# Altium project IMX8SoCIot.PrjPcb (part 2 of 4)

## Sheet IMX8_IO.SchDoc
size 594 x 420 mm; SheetNumber: 4; SheetTotal: 12
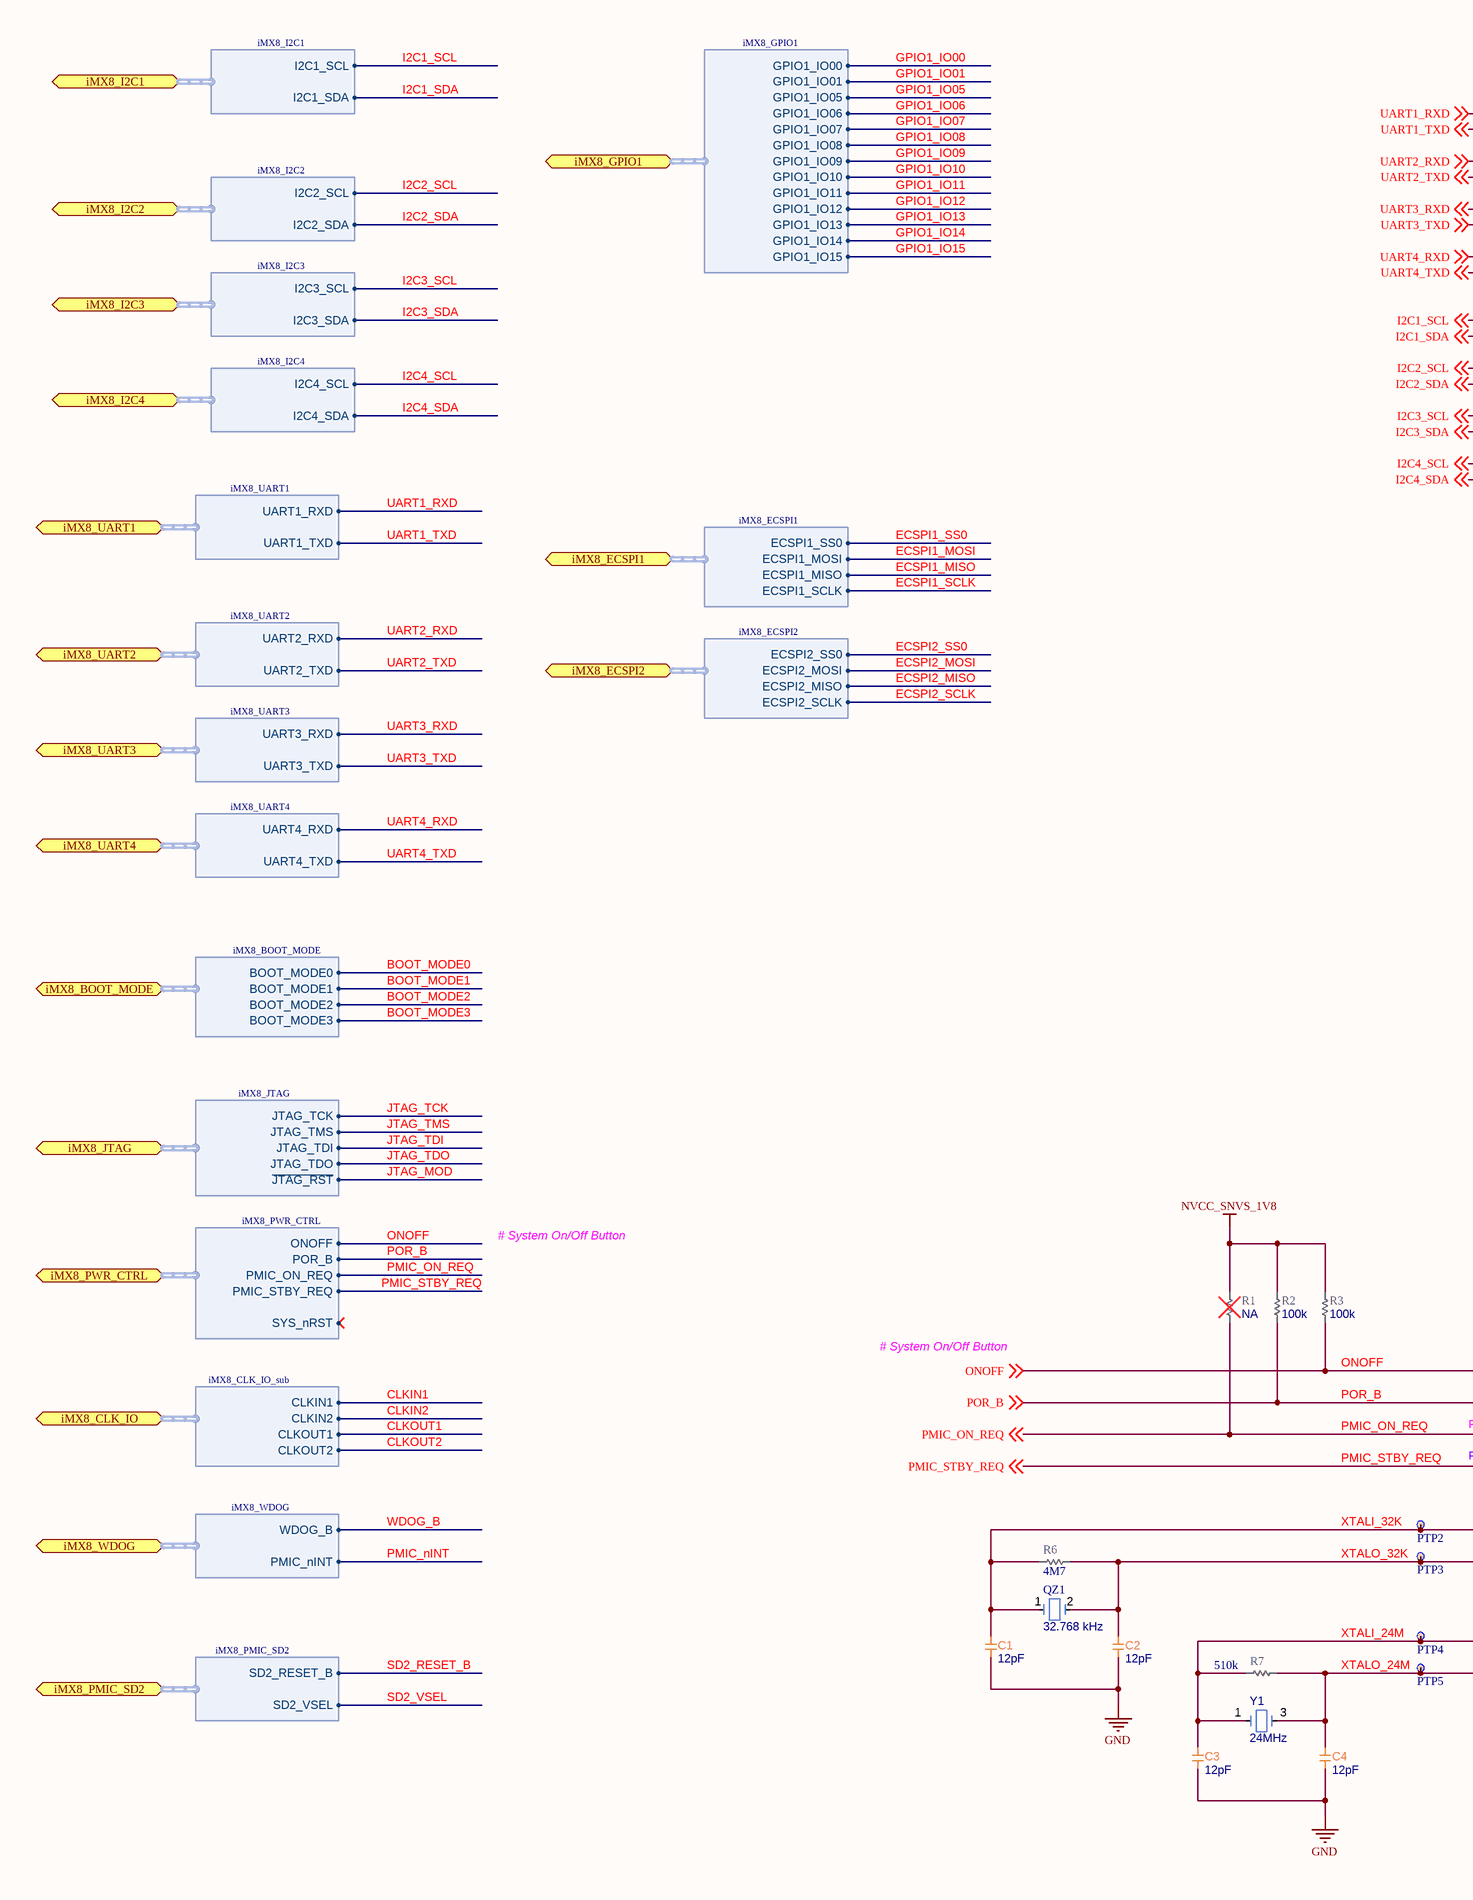
[diagram p8: IMX8_IO.SchDoc, left]
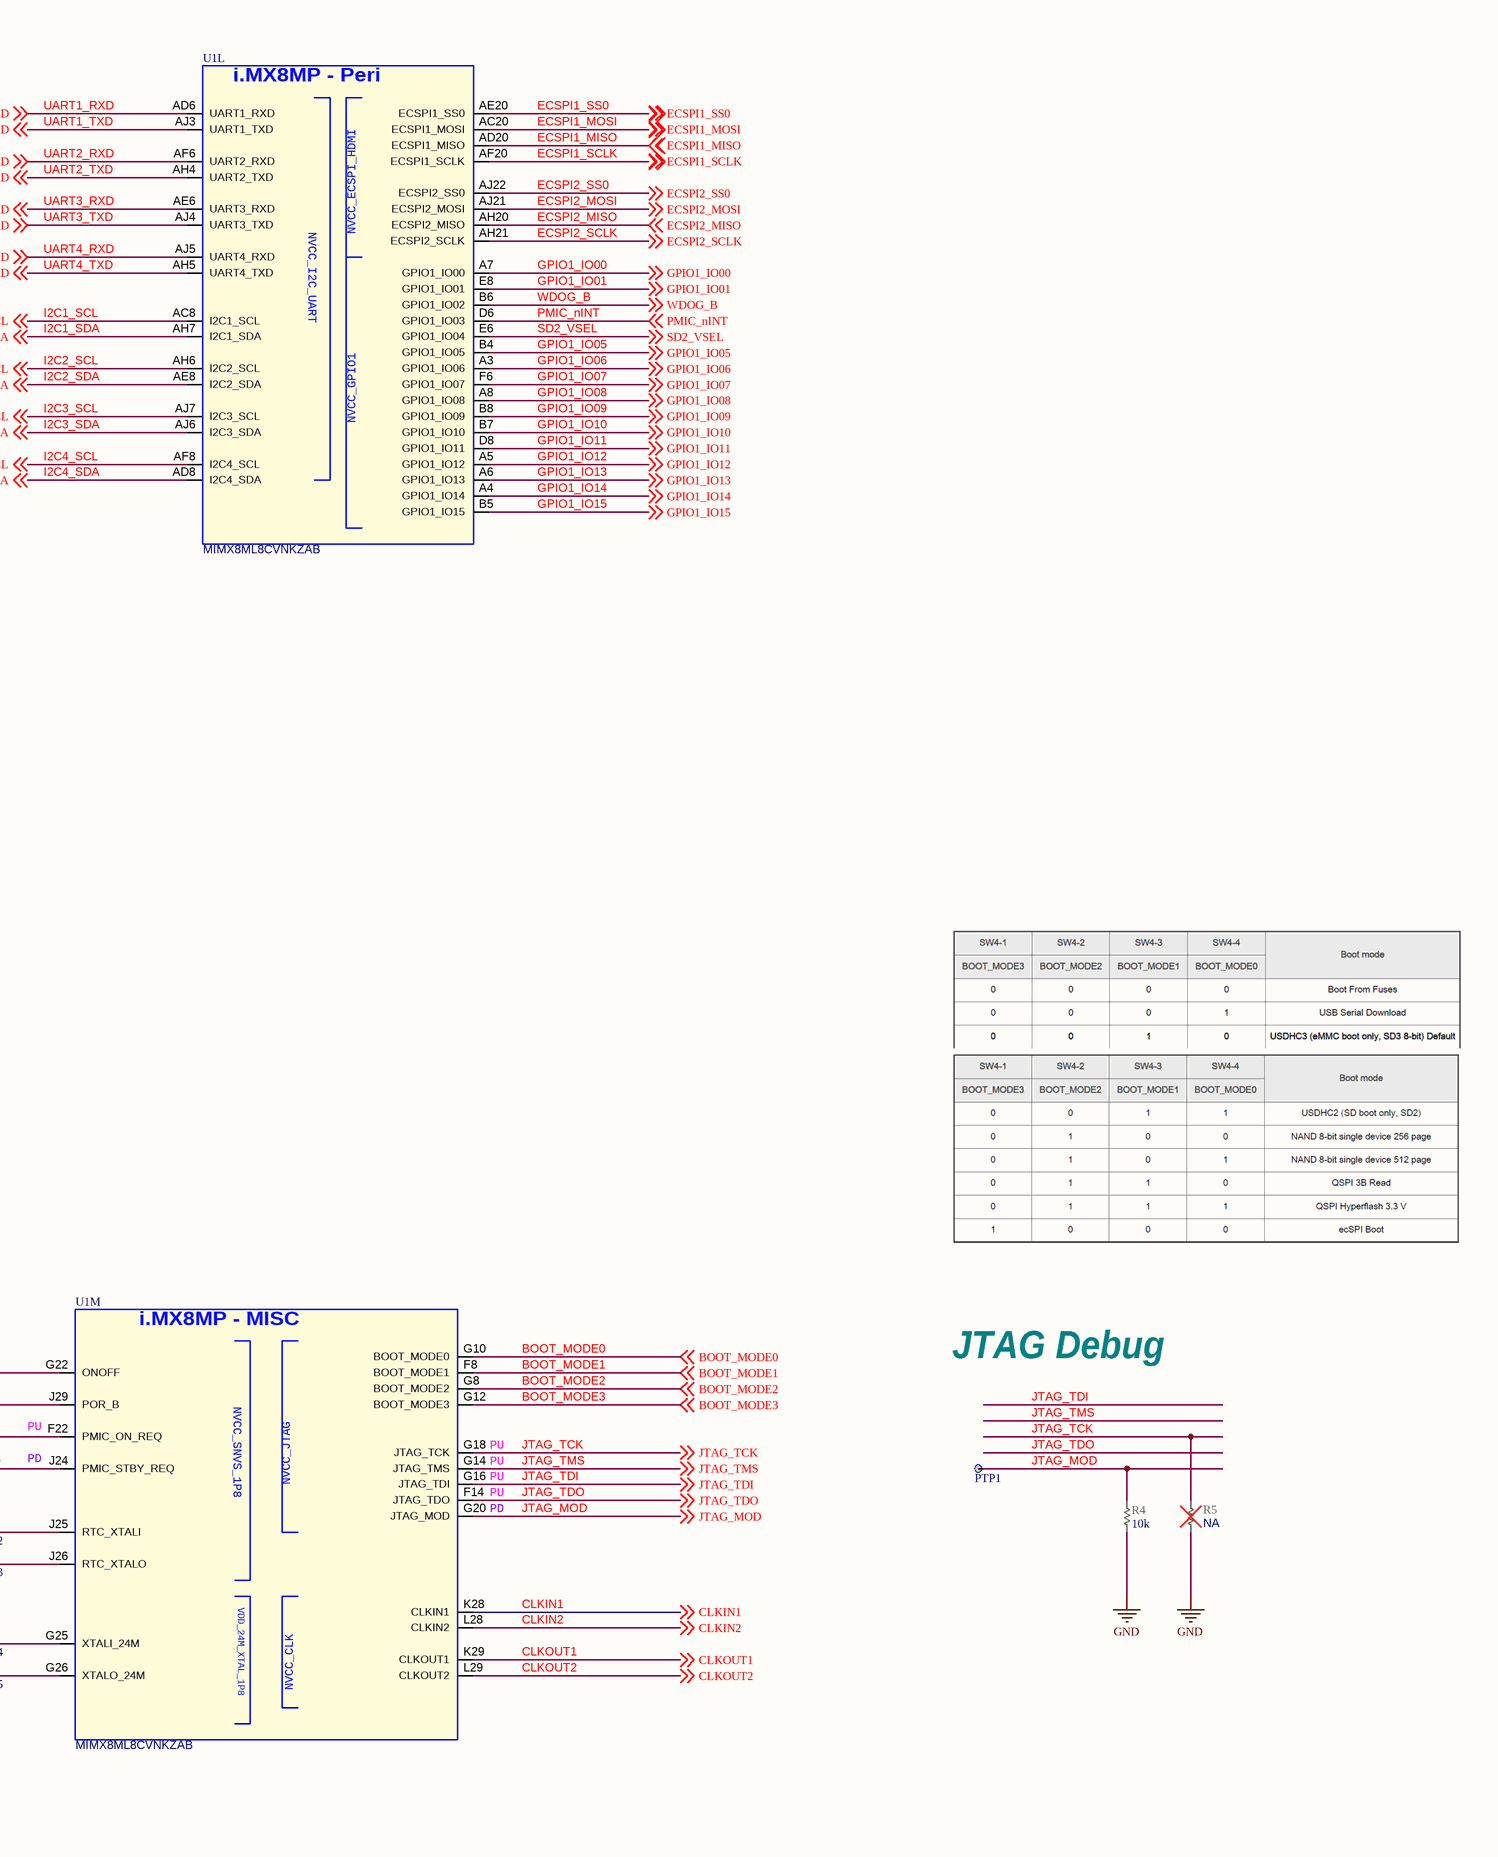
[diagram p9: IMX8_IO.SchDoc, right]

### Parts
C1  value 12pF  [CAP_0201_UN1Q]  (hidden comment: CAP_0201_12pF_RF_MATCHING)
C2  value 12pF  [CAP_0201_UN1Q]  (hidden comment: CAP_0201_12pF_RF_MATCHING)
C3  value 12pF  [CAP_0201_UN1Q]  (hidden comment: CAP_0201_12pF_RF_MATCHING)
C4  value 12pF  [CAP_0201_UN1Q]  (hidden comment: CAP_0201_12pF_RF_MATCHING)
PTP1  PTP_0.4mm  [PTP_0.4mm]  (value not drawn)  (no BOM)
PTP2  PTP_0.4mm  [PTP_0.4mm]  (value not drawn)  (no BOM)
PTP3  PTP_0.4mm  [PTP_0.4mm]  (value not drawn)  (no BOM)
PTP4  PTP_0.4mm  [PTP_0.4mm]  (value not drawn)  (no BOM)
PTP5  PTP_0.4mm  [PTP_0.4mm]  (value not drawn)  (no BOM)
QZ1  value 32.768 kHz  [CM8V32768TA020125_MC]  (hidden comment: XTAL_CM8V-T1A-32_768KHZ-9PF-20PPM-TA-QC)
R1  value NA  [RES_0201_UN1Q]  (hidden comment: RES_0201_NA)
R2  value 100k  [RES_0201_UN1Q]  (hidden comment: RES_0201_100k)
R3  value 100k  [RES_0201_UN1Q]  (hidden comment: RES_0201_100k)
R4  value 10k  [RES_0201_UN1Q]  (hidden comment: RES_0201_10k)
R5  value NA  [RES_0201_UN1Q]  (hidden comment: RES_0201_NA)
R6  value 4M7  [RES_0201_UN1Q]  (hidden comment: RES_0201_4M7)
R7  value 510k  [RES_0201_UN1Q]  (hidden comment: RES_0201_510k)
U1  MIMX8ML8CVNKZAB  [BGA548C50P29X29_1500X1500X148]  (parts L,M of 15)
Y1  value 24MHz  [XTAL_3225_EPSON]  (hidden comment: XTAL_24M_10ppm_9pF_+105C)

### Ports
iMX8_BOOT_MODE (bidir, harness iMX8_BOOT_MODE), iMX8_CLK_IO (bidir, harness iMX8_CLK_IO_sub), iMX8_ECSPI1 (bidir, harness iMX8_ECSPI1), iMX8_ECSPI2 (bidir, harness iMX8_ECSPI2), iMX8_GPIO1 (bidir, harness iMX8_GPIO1), iMX8_I2C1 (bidir, harness iMX8_I2C1), iMX8_I2C2 (bidir, harness iMX8_I2C2), iMX8_I2C3 (bidir, harness iMX8_I2C3), iMX8_I2C4 (bidir, harness iMX8_I2C4), iMX8_JTAG (bidir, harness iMX8_JTAG), iMX8_PMIC_SD2 (bidir, harness iMX8_PMIC_SD2), iMX8_PWR_CTRL (bidir, harness iMX8_PWR_CTRL), iMX8_UART1 (bidir, harness iMX8_UART1), iMX8_UART2 (bidir, harness iMX8_UART2), iMX8_UART3 (bidir, harness iMX8_UART3), iMX8_UART4 (bidir, harness iMX8_UART4), iMX8_WDOG (bidir, harness iMX8_WDOG)

### Harnesses
iMX8_JTAG: JTAG_TCK, JTAG_TMS, JTAG_TDI, JTAG_TDO, ~{JTAG_RST}
iMX8_CLK_IO_sub: CLKIN1, CLKIN2, CLKOUT1, CLKOUT2
iMX8_PWR_CTRL: ONOFF, POR_B, PMIC_ON_REQ, PMIC_STBY_REQ, SYS_nRST
iMX8_I2C1: I2C1_SCL, I2C1_SDA
iMX8_I2C2: I2C2_SCL, I2C2_SDA
iMX8_I2C3: I2C3_SCL, I2C3_SDA
iMX8_I2C4: I2C4_SCL, I2C4_SDA
iMX8_UART1: UART1_RXD, UART1_TXD
iMX8_UART2: UART2_RXD, UART2_TXD
iMX8_UART3: UART3_RXD, UART3_TXD
iMX8_UART4: UART4_RXD, UART4_TXD
iMX8_GPIO1: GPIO1_IO00, GPIO1_IO01, GPIO1_IO05, GPIO1_IO06, GPIO1_IO07, GPIO1_IO08, GPIO1_IO09, GPIO1_IO10, GPIO1_IO11, GPIO1_IO12, GPIO1_IO13, GPIO1_IO14, GPIO1_IO15
iMX8_ECSPI1: ECSPI1_SS0, ECSPI1_MOSI, ECSPI1_MISO, ECSPI1_SCLK
iMX8_WDOG: WDOG_B, PMIC_nINT
iMX8_PMIC_SD2: SD2_RESET_B, SD2_VSEL
iMX8_ECSPI2: ECSPI2_SS0, ECSPI2_MOSI, ECSPI2_MISO, ECSPI2_SCLK
iMX8_BOOT_MODE: BOOT_MODE0, BOOT_MODE1, BOOT_MODE2, BOOT_MODE3

### Nets
GND: C1.1 C2.2 C3.2 C4.2 R4.2 R5.2 Y1.2(GND) Y1.4(GND)
NVCC_SNVS_1V8: R1.1 R2.1 R3.1
BOOT_MODE0: U1.G10(BOOT_MODE0) ; off-sheet BOOT_MODE0, port iMX8_BOOT_MODE.BOOT_MODE0
BOOT_MODE1: U1.F8(BOOT_MODE1) ; off-sheet BOOT_MODE1, port iMX8_BOOT_MODE.BOOT_MODE1
BOOT_MODE2: U1.G8(BOOT_MODE2) ; off-sheet BOOT_MODE2, port iMX8_BOOT_MODE.BOOT_MODE2
BOOT_MODE3: U1.G12(BOOT_MODE3) ; off-sheet BOOT_MODE3, port iMX8_BOOT_MODE.BOOT_MODE3
CLKIN1: U1.K28(CLKIN1) ; off-sheet CLKIN1, port iMX8_CLK_IO.CLKIN1
CLKIN2: U1.L28(CLKIN2) ; off-sheet CLKIN2, port iMX8_CLK_IO.CLKIN2
CLKOUT1: U1.K29(CLKOUT1) ; off-sheet CLKOUT1, port iMX8_CLK_IO.CLKOUT1
CLKOUT2: U1.L29(CLKOUT2) ; off-sheet CLKOUT2, port iMX8_CLK_IO.CLKOUT2
ECSPI1_MISO: U1.AD20(ECSPI1_MISO) ; off-sheet ECSPI1_MISO, port iMX8_ECSPI1.ECSPI1_MISO
ECSPI1_MOSI: U1.AC20(ECSPI1_MOSI) ; off-sheet ECSPI1_MOSI, port iMX8_ECSPI1.ECSPI1_MOSI
ECSPI1_SCLK: U1.AF20(ECSPI1_SCLK) ; off-sheet ECSPI1_SCLK, port iMX8_ECSPI1.ECSPI1_SCLK  [project net ~{mPCIe_RST}]
ECSPI1_SS0: U1.AE20(ECSPI1_SS0) ; off-sheet ECSPI1_SS0, port iMX8_ECSPI1.ECSPI1_SS0  [project net ~{USB_HUB_RST}]
ECSPI2_MISO: U1.AH20(ECSPI2_MISO) ; off-sheet ECSPI2_MISO, port iMX8_ECSPI2.ECSPI2_MISO
ECSPI2_MOSI: U1.AJ21(ECSPI2_MOSI) ; off-sheet ECSPI2_MOSI, port iMX8_ECSPI2.ECSPI2_MOSI
ECSPI2_SCLK: U1.AH21(ECSPI2_SCLK) ; off-sheet ECSPI2_SCLK, port iMX8_ECSPI2.ECSPI2_SCLK
ECSPI2_SS0: U1.AJ22(ECSPI2_SS0) ; off-sheet ECSPI2_SS0, port iMX8_ECSPI2.ECSPI2_SS0
GPIO1_IO00: U1.A7(GPIO1_IO00) ; off-sheet GPIO1_IO00, port iMX8_GPIO1.GPIO1_IO00
GPIO1_IO01: U1.E8(GPIO1_IO01) ; off-sheet GPIO1_IO01, port iMX8_GPIO1.GPIO1_IO01
GPIO1_IO05: U1.B4(GPIO1_IO05) ; off-sheet GPIO1_IO05, port iMX8_GPIO1.GPIO1_IO05
GPIO1_IO06: U1.A3(GPIO1_IO06) ; off-sheet GPIO1_IO06, port iMX8_GPIO1.GPIO1_IO06
GPIO1_IO07: U1.F6(GPIO1_IO07) ; off-sheet GPIO1_IO07, port iMX8_GPIO1.GPIO1_IO07
GPIO1_IO08: U1.A8(GPIO1_IO08) ; off-sheet GPIO1_IO08, port iMX8_GPIO1.GPIO1_IO08
GPIO1_IO09: U1.B8(GPIO1_IO09) ; off-sheet GPIO1_IO09, port iMX8_GPIO1.GPIO1_IO09
GPIO1_IO10: U1.B7(GPIO1_IO10) ; off-sheet GPIO1_IO10, port iMX8_GPIO1.GPIO1_IO10
GPIO1_IO11: U1.D8(GPIO1_IO11) ; off-sheet GPIO1_IO11, port iMX8_GPIO1.GPIO1_IO11
GPIO1_IO12: U1.A5(GPIO1_IO12) ; off-sheet GPIO1_IO12, port iMX8_GPIO1.GPIO1_IO12
GPIO1_IO13: U1.A6(GPIO1_IO13) ; off-sheet GPIO1_IO13, port iMX8_GPIO1.GPIO1_IO13
GPIO1_IO14: U1.A4(GPIO1_IO14) ; off-sheet GPIO1_IO14, port iMX8_GPIO1.GPIO1_IO14
GPIO1_IO15: U1.B5(GPIO1_IO15) ; off-sheet GPIO1_IO15, port iMX8_GPIO1.GPIO1_IO15
I2C1_SCL: U1.AC8(I2C1_SCL) ; off-sheet I2C1_SCL, port iMX8_I2C1.I2C1_SCL
I2C1_SDA: U1.AH7(I2C1_SDA) ; off-sheet I2C1_SDA, port iMX8_I2C1.I2C1_SDA
I2C2_SCL: U1.AH6(I2C2_SCL) ; off-sheet I2C2_SCL, port iMX8_I2C2.I2C2_SCL
I2C2_SDA: U1.AE8(I2C2_SDA) ; off-sheet I2C2_SDA, port iMX8_I2C2.I2C2_SDA
I2C3_SCL: U1.AJ7(I2C3_SCL) ; off-sheet I2C3_SCL, port iMX8_I2C3.I2C3_SCL
I2C3_SDA: U1.AJ6(I2C3_SDA) ; off-sheet I2C3_SDA, port iMX8_I2C3.I2C3_SDA
I2C4_SCL: U1.AF8(I2C4_SCL) ; off-sheet I2C4_SCL, port iMX8_I2C4.I2C4_SCL
I2C4_SDA: U1.AD8(I2C4_SDA) ; off-sheet I2C4_SDA, port iMX8_I2C4.I2C4_SDA
JTAG_MOD: PTP1.1(TP) R4.1 U1.G20(JTAG_MOD) ; off-sheet JTAG_MOD, port iMX8_JTAG.~{JTAG_RST}  [project net ~{JTAG_RST}]
JTAG_TCK: R5.1 U1.G18(JTAG_TCK) ; off-sheet JTAG_TCK, port iMX8_JTAG.JTAG_TCK
JTAG_TDI: U1.G16(JTAG_TDI) ; off-sheet JTAG_TDI, port iMX8_JTAG.JTAG_TDI
JTAG_TDO: U1.F14(JTAG_TDO) ; off-sheet JTAG_TDO, port iMX8_JTAG.JTAG_TDO
JTAG_TMS: U1.G14(JTAG_TMS) ; off-sheet JTAG_TMS, port iMX8_JTAG.JTAG_TMS
ONOFF: R3.2 U1.G22(ONOFF) ; off-sheet ONOFF, port iMX8_PWR_CTRL.ONOFF
PMIC_nINT: U1.D6(GPIO1_IO03) ; off-sheet PMIC_nINT, port iMX8_WDOG.PMIC_nINT
PMIC_ON_REQ: R1.2 U1.F22(PMIC_ON_REQ) ; off-sheet PMIC_ON_REQ, port iMX8_PWR_CTRL.PMIC_ON_REQ
PMIC_STBY_REQ: U1.J24(PMIC_STBY_REQ) ; off-sheet PMIC_STBY_REQ, port iMX8_PWR_CTRL.PMIC_STBY_REQ
POR_B: R2.2 U1.J29(POR_B) ; off-sheet POR_B, port iMX8_PWR_CTRL.POR_B
SD2_VSEL: U1.E6(GPIO1_IO04) ; off-sheet SD2_VSEL, port iMX8_PMIC_SD2.SD2_VSEL
UART1_RXD: U1.AD6(UART1_RXD) ; off-sheet UART1_RXD, port iMX8_UART1.UART1_RXD
UART1_TXD: U1.AJ3(UART1_TXD) ; off-sheet UART1_TXD, port iMX8_UART1.UART1_TXD
UART2_RXD: U1.AF6(UART2_RXD) ; off-sheet UART2_RXD, port iMX8_UART2.UART2_RXD
UART2_TXD: U1.AH4(UART2_TXD) ; off-sheet UART2_TXD, port iMX8_UART2.UART2_TXD
UART3_RXD: U1.AE6(UART3_RXD) ; off-sheet UART3_RXD, port iMX8_UART3.UART3_RXD
UART3_TXD: U1.AJ4(UART3_TXD) ; off-sheet UART3_TXD, port iMX8_UART3.UART3_TXD
UART4_RXD: U1.AJ5(UART4_RXD) ; off-sheet UART4_RXD, port iMX8_UART4.UART4_RXD
UART4_TXD: U1.AH5(UART4_TXD) ; off-sheet UART4_TXD, port iMX8_UART4.UART4_TXD
WDOG_B: U1.B6(GPIO1_IO02) ; off-sheet WDOG_B, port iMX8_WDOG.WDOG_B
XTALI_24M: C3.1 PTP4.1(TP) R7.1 U1.G25(XTALI_24M) Y1.1
XTALI_32K: C1.2 PTP2.1(TP) QZ1.1 R6.1 U1.J25(RTC_XTALI)
XTALO_24M: C4.1 PTP5.1(TP) R7.2 U1.G26(XTALO_24M) Y1.3
XTALO_32K: C2.1 PTP3.1(TP) QZ1.2 R6.2 U1.J26(RTC_XTALO)

### Notes on the sheet
- # System On/Off Button
- JTAG Debug
- (near U1) PD
- (near U1) PU
- DWG NO:
- REV:
- THIS DOCUMENT AND THE DATA DISCLOSED HEREIN OR
- HEREWITH IS THE PROPERTY OF ALTIUM LIMITED AND MAY
- BE FREELY DISTRIBUTED IN WHOLE. NO RIGHTS ARE
- RESERVED OR EXPRESS OR IMPLIED WARANTEE GIVEN.
- REVISION
- DESCRIPTION
- DATE
- APPROVED
- ENG:
- APPROVALS
- PROJECT
- DSN:
- CHK:
- REFERENCE DOCUMENTS
- PROJECT REVISION:
- TITLE
- DOCUMENT REVISION:
- DESIGN ITEM:
- BOM:
- FAB DWG:
- PCB DWG:
- ASSY DWG:
- SCALE:
- A2
- SIZE
- CAGE CODE
- FILE NAME
- DWG NO.
- SHEET
- OF
- REV
- (in symbol CMP-001-000983-8, part L) i.MX8MP - Peri; NVCC_GPIO1
- (in symbol CMP-001-000983-8, part M) i.MX8MP - MISC

### Library data of the parts
C1-C4 = CMP-001-000420-11: CAP_RF_MATCHING; Part Number: GRM0335C1H120GA01; Manufacturer: Murata; Voltage: 50V; Tolerance: +/- 2%; Temperature characteristics: C0G; Remark: RF matching, use part number; Sort order: 202; HasBeenBuilt: TBD; System: RLC; Package: 0201; Operating temperature range: -55 ... +125C; ComponentLink1Description: 1_Datasheet; ComponentLink2Description: 2_Product page; ComponentLink3Description: 3_X-information; ComponentLink4Description: 4_X-information; Creation date: 20211123; ClassName: SMALL; Source: RLC_UN1Q.SchLib; Manufacturer Part Number: GRM0335C1H120GA01; Component Type: Capacitor
PTP1-PTP5 = CMP-001-001296-3: as PTP14 on sheet IMX8_eMMC; ComponentLink4Description: 4_X-information; ComponentLink1Description: 1_Datasheet; Sort order: -; ClassName: SMALL; System: Test Point; HasBeenBuilt: -; Design Item ID: PTP_0.4mm; ComponentLink3Description: 3_X-information; Creation date: 20240909; ComponentLink2Description: 2_Product page; Component Type: Test Point
QZ1 = CMP-001-000697-8: SMT Quartz Crystal; Manufacturer: Micro Crystal; Part Number: CM8V-T1A-32.768KHZ-9PF-20PPM-TA-QC; HasBeenBuilt: SleeveIO_01; Sort order: 455; System: Discrete; ClassName: BIG; ComponentLink1Description: 1_Datasheet; ComponentLink1URL: https://www.microcrystal.com/fileadmin/Media/Products/32kHz/Datasheet/CM8V-T1A.pdf; ComponentLink2Description: 2_Product page; ComponentLink2URL: https://www.microcrystal.com/en/products/khz-quartz-crystals/cm8v-t1a/; ComponentLink3Description: 3_X-information; ComponentLink4Description: 4_X-information; Creation date: 20210913; Dimensions WxLxH: 1.2x2.0x0.6mm; Operating temperature range: -40 .... +85 °C; Package: 2-SMD; Source: Discrete_UN1Q.SchLib; Manufacturer Part Number: CM8V-T1A-32.768KHZ-9PF-20PPM-TA-QC; Component Type: Crystal & Oscillator
R1 R5 = CMP-001-000434-10: as R22 on sheet IMX8_eMMC; Package: 0201; ClassName: SMALL; ComponentLink1Description: 1_Datasheet; ComponentLink2Description: 2_Product page; ComponentLink3Description: 3_X-information; ComponentLink4Description: 4_X-information; Creation date: 20190101; Source: RLC_UN1Q.SchLib; Component Type: Resistor
R2 R3 = CMP-001-000526-11: RES; Part Number: RC0201FR-07100KL; Manufacturer: YAGEO; Tolerance: 1%; Power Rating: 1/20W; Sort order: 322; HasBeenBuilt: TBD; Alternative component: Allowed; System: RLC; Package: 0201; ClassName: SMALL; ComponentLink1Description: 1_Datasheet; ComponentLink2Description: 2_Product page; ComponentLink3Description: 3_X-information; ComponentLink4Description: 4_X-information; Creation date: 20190101; Source: RLC_UN1Q.SchLib; Component Type: Resistor
R4 = CMP-001-000446-13: RES; Part Number: RC0201FR-0710KL; Manufacturer: YAGEO; Power Rating: 1/20W; Sort order: 322; HasBeenBuilt: TBD; Tolerance: 1%; Alternative component: Allowed; System: RLC; Package: 0201; ClassName: SMALL; ComponentLink1Description: 1_Datasheet; ComponentLink2Description: 2_Product page; ComponentLink3Description: 3_X-information; ComponentLink4Description: 4_X-information; Creation date: 20190101; Source: RLC_UN1Q.SchLib; Component Type: Resistor
R6 = CMP-001-001254-9: RES; Part Number: MCRE000254; Manufacturer: MULTICOMP PRO; Tolerance: 1%; Power Rating: 1/20W; Sort order: 322; Alternative component: Allowed; System: RLC; Package: 0201; ClassName: SMALL; ComponentLink1Description: 1_Datasheet; ComponentLink2Description: 2_Product page; ComponentLink3Description: 3_X-information; ComponentLink4Description: 4_X-information; Creation date: 20240404; Component Type: Resistor
R7 = CMP-001-000576-12: RES; Part Number: ERJ-1GNF5103C; Manufacturer: Panasonic Electronic Components; Sort order: 322; HasBeenBuilt: TBD; Alternative component: Allowed; System: RLC; Power Rating: 1/20W; Tolerance: 1%; Package: 0201; ComponentLink1Description: 1_Datasheet; ComponentLink2Description: 2_Product page; ComponentLink3Description: 3_X-information; ComponentLink4Description: 4_X-information; Creation date: 20211123; Source: RLC_UN1Q.SchLib; ClassName: SMALL; Component Type: Resistor
U1 = CMP-001-000983-8: as U1 on sheet IMX8_DISPLAY; ComponentLink1Description: 1_Datasheet; ComponentLink1URL: https://www.nxp.com/part/MIMX8ML8CVNKZAB#/; ComponentLink2Description: 2_Product page; ComponentLink3Description: 3_X-information; ComponentLink4Description: 4_X-information; Creation date: 20240524; Dimensions WxLxH: 15 x 15 x 1.33mm; Operating temperature range: -40... +105 °C; Package: FCBGA548; Part Number: MIMX8ML8CVNKZAB; ClassName: BIG; Source: UUDET_KOMPONENTIT.SchLib; Design Item ID: MIMX8ML8CVNKZAB; Manufacturer Part Number: MIMX8ML8CVNKZAB; Component Type: Processor
Y1 = CMP-001-001243-5: Crystal 24 MHz ±10ppm 9pF 40Ohms 4-SMD; Part Number: TSX-3225 24.0000MF20G-AC3; Manufacturer: Epson; Tolerance: +/-10ppm; Sort order: 455; System: Discrete; Operating temperature range: -40 ... +105C; Dimensions WxLxH: 3.2 x 2.5 x 0.6mm; ComponentLink1Description: 1_Datasheet; ComponentLink1URL: https://support.epson.biz/td/api/doc_check.php?dl=brief_TSX-3225&lang=en; ComponentLink2Description: 2_Product page; ComponentLink3Description: 3_X-information; ComponentLink4Description: 4_X-information; Creation date: 20240430; Manufacturer Part Number: TSX-3225 24.0000MF20G-AC3; Component Type: Crystal & Oscillator

## Sheet IMX8_LPDDR4.SchDoc
size 594 x 420 mm; SheetNumber: 6; SheetTotal: 12
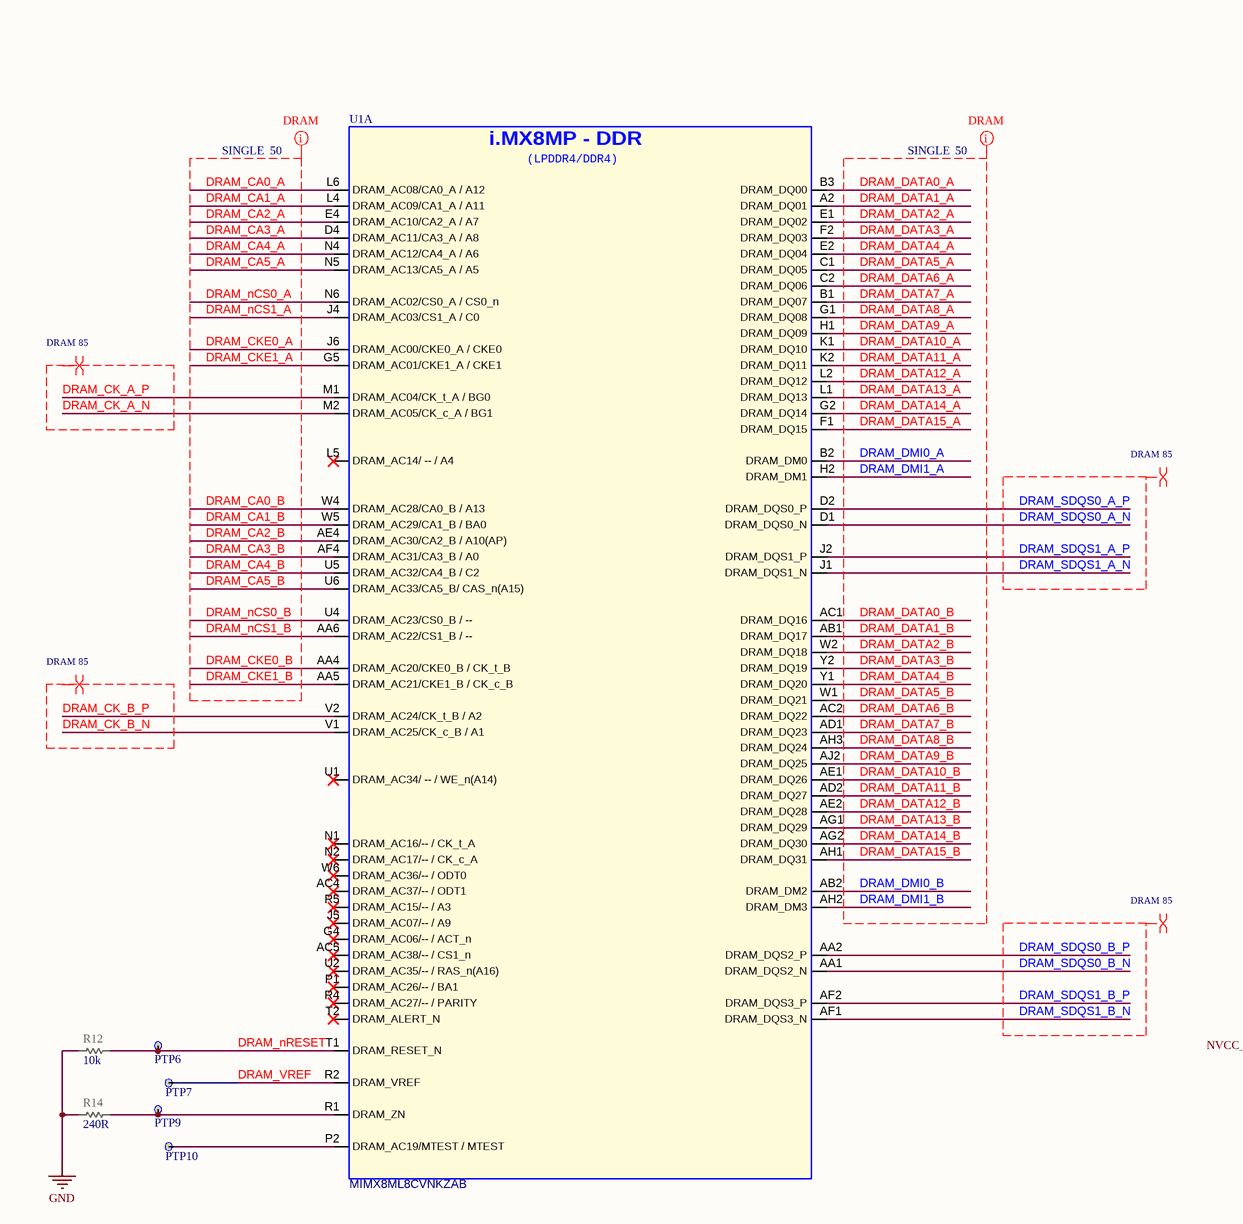
[diagram p10: IMX8_LPDDR4.SchDoc, top left]
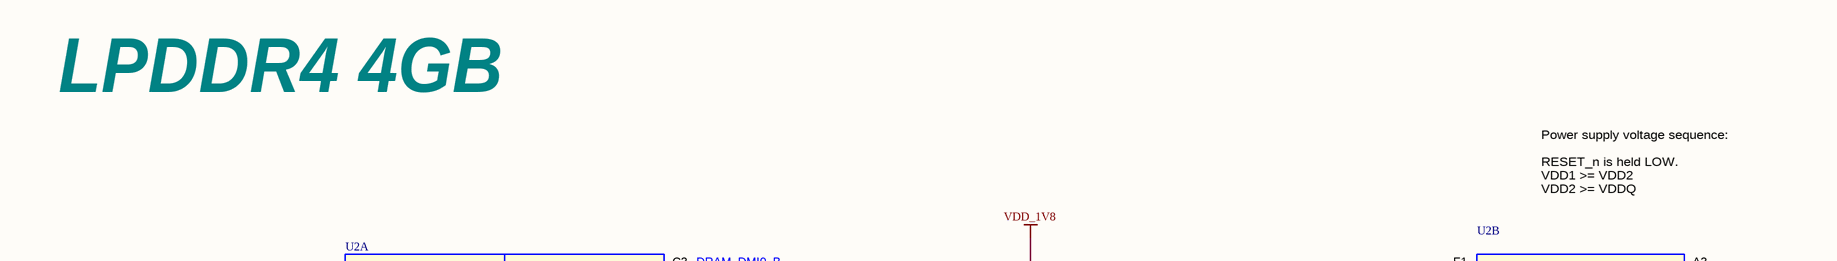
[diagram p11: IMX8_LPDDR4.SchDoc, top right]
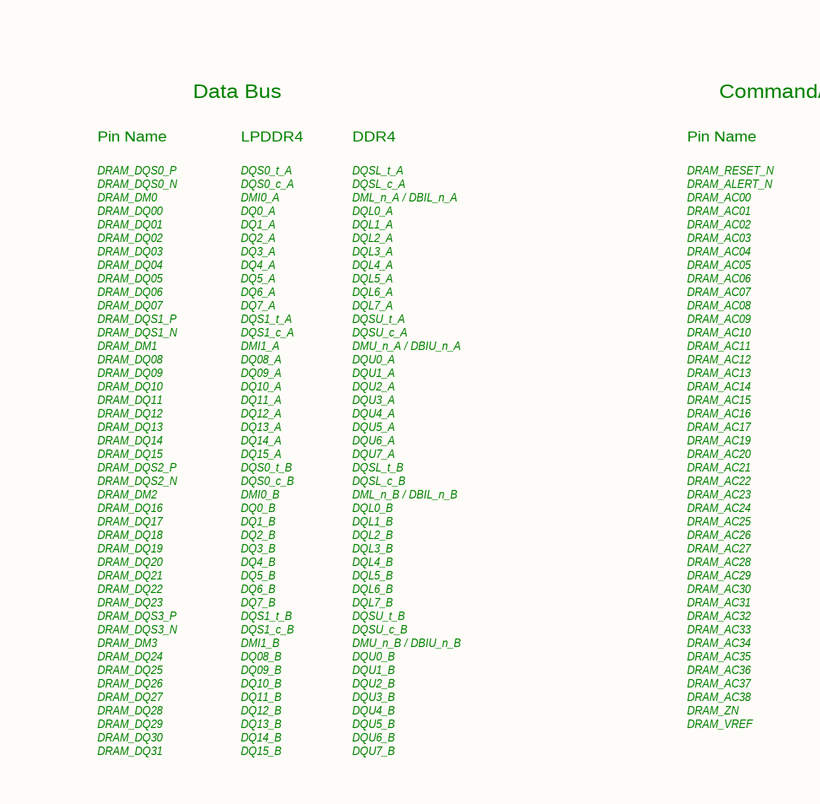
[diagram p12: IMX8_LPDDR4.SchDoc, bottom left]
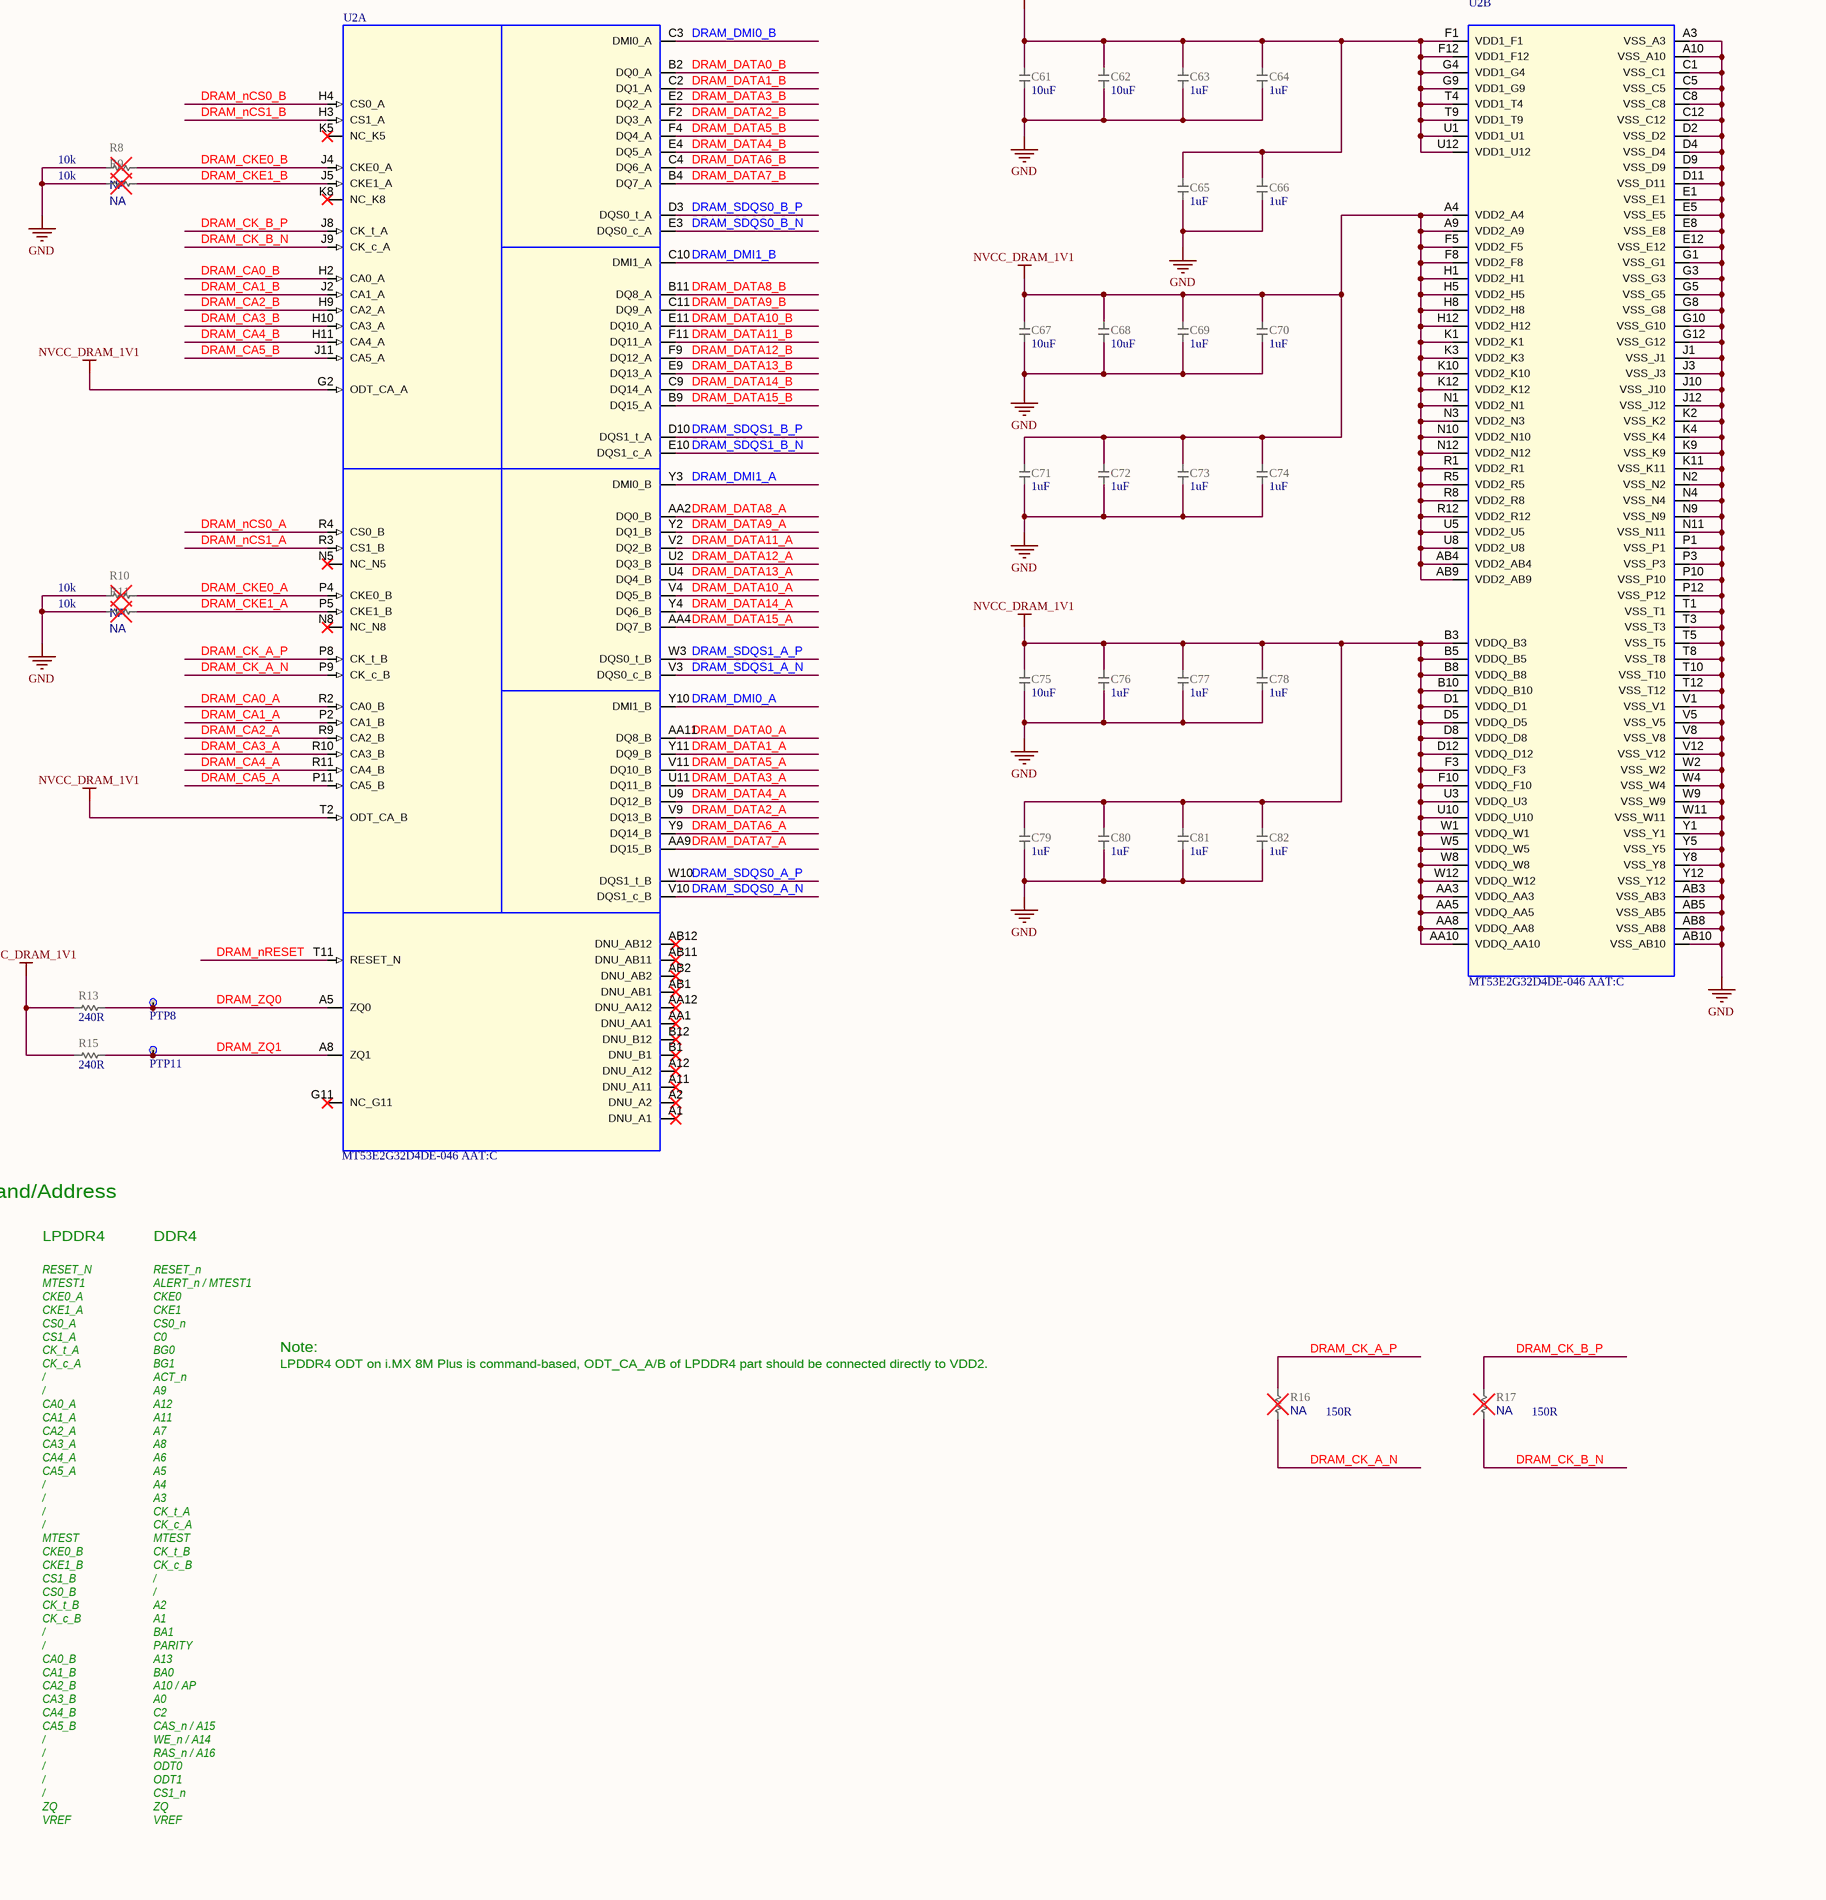
[diagram p13: IMX8_LPDDR4.SchDoc, bottom right]

### Parts
C61  value 10uF  [CAP_0402_H09W07_UN1Q]  (hidden comment: CAP_0402_10u_X6S)
C62  value 10uF  [CAP_0402_H09W07_UN1Q]  (hidden comment: CAP_0402_10u_X6S)
C63  value 1uF  [CAP_0201_UN1Q]  (hidden comment: CAP_0201_1uF_X6S)
C64  value 1uF  [CAP_0201_UN1Q]  (hidden comment: CAP_0201_1uF_X6S)
C65  value 1uF  [CAP_0201_UN1Q]  (hidden comment: CAP_0201_1uF_X6S)
C66  value 1uF  [CAP_0201_UN1Q]  (hidden comment: CAP_0201_1uF_X6S)
C67  value 10uF  [CAP_0402_H09W07_UN1Q]  (hidden comment: CAP_0402_10u_X6S)
C68  value 10uF  [CAP_0402_H09W07_UN1Q]  (hidden comment: CAP_0402_10u_X6S)
C69  value 1uF  [CAP_0201_UN1Q]  (hidden comment: CAP_0201_1uF_X6S)
C70  value 1uF  [CAP_0201_UN1Q]  (hidden comment: CAP_0201_1uF_X6S)
C71  value 1uF  [CAP_0201_UN1Q]  (hidden comment: CAP_0201_1uF_X6S)
C72  value 1uF  [CAP_0201_UN1Q]  (hidden comment: CAP_0201_1uF_X6S)
C73  value 1uF  [CAP_0201_UN1Q]  (hidden comment: CAP_0201_1uF_X6S)
C74  value 1uF  [CAP_0201_UN1Q]  (hidden comment: CAP_0201_1uF_X6S)
C75  value 10uF  [CAP_0402_H09W07_UN1Q]  (hidden comment: CAP_0402_10u_X6S)
C76  value 1uF  [CAP_0201_UN1Q]  (hidden comment: CAP_0201_1uF_X6S)
C77  value 1uF  [CAP_0201_UN1Q]  (hidden comment: CAP_0201_1uF_X6S)
C78  value 1uF  [CAP_0201_UN1Q]  (hidden comment: CAP_0201_1uF_X6S)
C79  value 1uF  [CAP_0201_UN1Q]  (hidden comment: CAP_0201_1uF_X6S)
C80  value 1uF  [CAP_0201_UN1Q]  (hidden comment: CAP_0201_1uF_X6S)
C81  value 1uF  [CAP_0201_UN1Q]  (hidden comment: CAP_0201_1uF_X6S)
C82  value 1uF  [CAP_0201_UN1Q]  (hidden comment: CAP_0201_1uF_X6S)
PTP6  PTP_0.4mm  [PTP_0.4mm]  (value not drawn)  (no BOM)
PTP7  PTP_0.4mm  [PTP_0.4mm]  (value not drawn)  (no BOM)
PTP8  PTP_0.4mm  [PTP_0.4mm]  (value not drawn)  (no BOM)
PTP9  PTP_0.4mm  [PTP_0.4mm]  (value not drawn)  (no BOM)
PTP10  PTP_0.4mm  [PTP_0.4mm]  (value not drawn)  (no BOM)
PTP11  PTP_0.4mm  [PTP_0.4mm]  (value not drawn)  (no BOM)
R8  value NA  [RES_0201_UN1Q]  (hidden comment: RES_0201_NA)
R9  value NA  [RES_0201_UN1Q]  (hidden comment: RES_0201_NA)
R10  value NA  [RES_0201_UN1Q]  (hidden comment: RES_0201_NA)
R11  value NA  [RES_0201_UN1Q]  (hidden comment: RES_0201_NA)
R12  value 10k  [RES_0201_UN1Q]  (hidden comment: RES_0201_10k)
R13  value 240R  [RES_0201_UN1Q]  (hidden comment: RES_0201_240R)
R14  value 240R  [RES_0201_UN1Q]  (hidden comment: RES_0201_240R)
R15  value 240R  [RES_0201_UN1Q]  (hidden comment: RES_0201_240R)
R16  value NA  [RES_0201_UN1Q]  (hidden comment: RES_0201_NA)
R17  value NA  [RES_0201_UN1Q]  (hidden comment: RES_0201_NA)
U1  MIMX8ML8CVNKZAB  [BGA548C50P29X29_1500X1500X148]  (part A of 15)
U2  MT53E2G32D4DE-046 AAT:C  [BGA200C65P12X22_1000X1450X114]  (parts A,B of 2)

### Nets
GND: C61.2 C62.2 C63.2 C64.2 C65.2 C66.2 C67.2 C68.2 C69.2 C70.2 C71.2 C72.2 C73.2 C74.2 C75.2 C76.2 C77.2 C78.2 C79.2 C80.2 C81.2 C82.2 R8.1 R9.1 R10.1 R11.1 R12.1 R14.1 U2.A3(VSS_A3) U2.A10(VSS_A10) U2.AB3(VSS_AB3) U2.AB5(VSS_AB5) U2.AB8(VSS_AB8) U2.AB10(VSS_AB10) U2.C1(VSS_C1) U2.C5(VSS_C5) U2.C8(VSS_C8) U2.C12(VSS_C12) U2.D2(VSS_D2) U2.D4(VSS_D4) U2.D9(VSS_D9) U2.D11(VSS_D11) U2.E1(VSS_E1) U2.E5(VSS_E5) U2.E8(VSS_E8) U2.E12(VSS_E12) U2.G1(VSS_G1) U2.G3(VSS_G3) U2.G5(VSS_G5) U2.G8(VSS_G8) U2.G10(VSS_G10) U2.G12(VSS_G12) U2.J1(VSS_J1) U2.J3(VSS_J3) U2.J10(VSS_J10) U2.J12(VSS_J12) U2.K2(VSS_K2) U2.K4(VSS_K4) U2.K9(VSS_K9) U2.K11(VSS_K11) U2.N2(VSS_N2) U2.N4(VSS_N4) U2.N9(VSS_N9) U2.N11(VSS_N11) U2.P1(VSS_P1) U2.P3(VSS_P3) U2.P10(VSS_P10) U2.P12(VSS_P12) U2.T1(VSS_T1) U2.T3(VSS_T3) U2.T5(VSS_T5) U2.T8(VSS_T8) U2.T10(VSS_T10) U2.T12(VSS_T12) U2.V1(VSS_V1) U2.V5(VSS_V5) U2.V8(VSS_V8) U2.V12(VSS_V12) U2.W2(VSS_W2) U2.W4(VSS_W4) U2.W9(VSS_W9) U2.W11(VSS_W11) U2.Y1(VSS_Y1) U2.Y5(VSS_Y5) U2.Y8(VSS_Y8) U2.Y12(VSS_Y12)
NVCC_DRAM_1V1: C67.1 C68.1 C69.1 C70.1 C71.1 C72.1 C73.1 C74.1 C75.1 C76.1 C77.1 C78.1 C79.1 C80.1 C81.1 C82.1 R13.1 R15.1 U2.A4(VDD2_A4) U2.A9(VDD2_A9) U2.AA3(VDDQ_AA3) U2.AA5(VDDQ_AA5) U2.AA8(VDDQ_AA8) U2.AA10(VDDQ_AA10) U2.AB4(VDD2_AB4) U2.AB9(VDD2_AB9) U2.B3(VDDQ_B3) U2.B5(VDDQ_B5) U2.B8(VDDQ_B8) U2.B10(VDDQ_B10) U2.D1(VDDQ_D1) U2.D5(VDDQ_D5) U2.D8(VDDQ_D8) U2.D12(VDDQ_D12) U2.F3(VDDQ_F3) U2.F5(VDD2_F5) U2.F8(VDD2_F8) U2.F10(VDDQ_F10) U2.G2(ODT_CA_A) U2.H1(VDD2_H1) U2.H5(VDD2_H5) U2.H8(VDD2_H8) U2.H12(VDD2_H12) U2.K1(VDD2_K1) U2.K3(VDD2_K3) U2.K10(VDD2_K10) U2.K12(VDD2_K12) U2.N1(VDD2_N1) U2.N3(VDD2_N3) U2.N10(VDD2_N10) U2.N12(VDD2_N12) U2.R1(VDD2_R1) U2.R5(VDD2_R5) U2.R8(VDD2_R8) U2.R12(VDD2_R12) U2.T2(ODT_CA_B) U2.U3(VDDQ_U3) U2.U5(VDD2_U5) U2.U8(VDD2_U8) U2.U10(VDDQ_U10) U2.W1(VDDQ_W1) U2.W5(VDDQ_W5) U2.W8(VDDQ_W8) U2.W12(VDDQ_W12)
VDD_1V8: C61.1 C62.1 C63.1 C64.1 C65.1 C66.1 U2.F1(VDD1_F1) U2.F12(VDD1_F12) U2.G4(VDD1_G4) U2.G9(VDD1_G9) U2.T4(VDD1_T4) U2.T9(VDD1_T9) U2.U1(VDD1_U1) U2.U12(VDD1_U12)
DRAM_CA0_A: U1.L6(DRAM_AC08/CA0_A_/_A12) U2.R2(CA0_B)
DRAM_CA0_B: U1.W4(DRAM_AC28/CA0_B_/_A13) U2.H2(CA0_A)
DRAM_CA1_A: U1.L4(DRAM_AC09/CA1_A_/_A11) U2.P2(CA1_B)
DRAM_CA1_B: U1.W5(DRAM_AC29/CA1_B_/_BA0) U2.J2(CA1_A)
DRAM_CA2_A: U1.E4(DRAM_AC10/CA2_A_/_A7) U2.R9(CA2_B)
DRAM_CA2_B: U1.AE4(DRAM_AC30/CA2_B_/_A10(AP)) U2.H9(CA2_A)
DRAM_CA3_A: U1.D4(DRAM_AC11/CA3_A_/_A8) U2.R10(CA3_B)
DRAM_CA3_B: U1.AF4(DRAM_AC31/CA3_B_/_A0) U2.H10(CA3_A)
DRAM_CA4_A: U1.N4(DRAM_AC12/CA4_A_/_A6) U2.R11(CA4_B)
DRAM_CA4_B: U1.U5(DRAM_AC32/CA4_B_/_C2) U2.H11(CA4_A)
DRAM_CA5_A: U1.N5(DRAM_AC13/CA5_A_/_A5) U2.P11(CA5_B)
DRAM_CA5_B: U1.U6(DRAM_AC33/CA5_B/_CAS_n(A15)) U2.J11(CA5_A)
DRAM_CK_A_N: R16.1 U1.M2(DRAM_AC05/CK_c_A_/_BG1) U2.P9(CK_c_B)
DRAM_CK_A_P: R16.2 U1.M1(DRAM_AC04/CK_t_A_/_BG0) U2.P8(CK_t_B)
DRAM_CK_B_N: R17.1 U1.V1(DRAM_AC25/CK_c_B_/_A1) U2.J9(CK_c_A)
DRAM_CK_B_P: R17.2 U1.V2(DRAM_AC24/CK_t_B_/_A2) U2.J8(CK_t_A)
DRAM_CKE0_A: R10.2 U1.J6(DRAM_AC00/CKE0_A_/_CKE0) U2.P4(CKE0_B)
DRAM_CKE0_B: R8.2 U1.AA4(DRAM_AC20/CKE0_B_/_CK_t_B) U2.J4(CKE0_A)
DRAM_CKE1_A: R11.2 U1.G5(DRAM_AC01/CKE1_A_/_CKE1) U2.P5(CKE1_B)
DRAM_CKE1_B: R9.2 U1.AA5(DRAM_AC21/CKE1_B_/_CK_c_B) U2.J5(CKE1_A)
DRAM_DATA0_A: U1.B3(DRAM_DQ00) U2.AA11(DQ8_B)
DRAM_DATA0_B: U1.AC1(DRAM_DQ16) U2.B2(DQ0_A)
DRAM_DATA1_A: U1.A2(DRAM_DQ01) U2.Y11(DQ9_B)
DRAM_DATA1_B: U1.AB1(DRAM_DQ17) U2.C2(DQ1_A)
DRAM_DATA2_A: U1.E1(DRAM_DQ02) U2.V9(DQ13_B)
DRAM_DATA2_B: U1.W2(DRAM_DQ18) U2.F2(DQ3_A)
DRAM_DATA3_A: U1.F2(DRAM_DQ03) U2.U11(DQ11_B)
DRAM_DATA3_B: U1.Y2(DRAM_DQ19) U2.E2(DQ2_A)
DRAM_DATA4_A: U1.E2(DRAM_DQ04) U2.U9(DQ12_B)
DRAM_DATA4_B: U1.Y1(DRAM_DQ20) U2.E4(DQ5_A)
DRAM_DATA5_A: U1.C1(DRAM_DQ05) U2.V11(DQ10_B)
DRAM_DATA5_B: U1.W1(DRAM_DQ21) U2.F4(DQ4_A)
DRAM_DATA6_A: U1.C2(DRAM_DQ06) U2.Y9(DQ14_B)
DRAM_DATA6_B: U1.AC2(DRAM_DQ22) U2.C4(DQ6_A)
DRAM_DATA7_A: U1.B1(DRAM_DQ07) U2.AA9(DQ15_B)
DRAM_DATA7_B: U1.AD1(DRAM_DQ23) U2.B4(DQ7_A)
DRAM_DATA8_A: U1.G1(DRAM_DQ08) U2.AA2(DQ0_B)
DRAM_DATA8_B: U1.AH3(DRAM_DQ24) U2.B11(DQ8_A)
DRAM_DATA9_A: U1.H1(DRAM_DQ09) U2.Y2(DQ1_B)
DRAM_DATA9_B: U1.AJ2(DRAM_DQ25) U2.C11(DQ9_A)
DRAM_DATA10_A: U1.K1(DRAM_DQ10) U2.V4(DQ5_B)
DRAM_DATA10_B: U1.AE1(DRAM_DQ26) U2.E11(DQ10_A)
DRAM_DATA11_A: U1.K2(DRAM_DQ11) U2.V2(DQ2_B)
DRAM_DATA11_B: U1.AD2(DRAM_DQ27) U2.F11(DQ11_A)
DRAM_DATA12_A: U1.L2(DRAM_DQ12) U2.U2(DQ3_B)
DRAM_DATA12_B: U1.AE2(DRAM_DQ28) U2.F9(DQ12_A)
DRAM_DATA13_A: U1.L1(DRAM_DQ13) U2.U4(DQ4_B)
DRAM_DATA13_B: U1.AG1(DRAM_DQ29) U2.E9(DQ13_A)
DRAM_DATA14_A: U1.G2(DRAM_DQ14) U2.Y4(DQ6_B)
DRAM_DATA14_B: U1.AG2(DRAM_DQ30) U2.C9(DQ14_A)
DRAM_DATA15_A: U1.F1(DRAM_DQ15) U2.AA4(DQ7_B)
DRAM_DATA15_B: U1.AH1(DRAM_DQ31) U2.B9(DQ15_A)
DRAM_DMI0_A: U1.B2(DRAM_DM0) U2.Y10(DMI1_B)
DRAM_DMI0_B: U1.AB2(DRAM_DM2) U2.C3(DMI0_A)
DRAM_DMI1_A: U1.H2(DRAM_DM1) U2.Y3(DMI0_B)
DRAM_DMI1_B: U1.AH2(DRAM_DM3) U2.C10(DMI1_A)
DRAM_nCS0_A: U1.N6(DRAM_AC02/CS0_A_/_CS0_n) U2.R4(CS0_B)
DRAM_nCS0_B: U1.U4(DRAM_AC23/CS0_B_/_--) U2.H4(CS0_A)
DRAM_nCS1_A: U1.J4(DRAM_AC03/CS1_A_/_C0) U2.R3(CS1_B)
DRAM_nCS1_B: U1.AA6(DRAM_AC22/CS1_B_/_--) U2.H3(CS1_A)
DRAM_nRESET: PTP6.1(TP) R12.2 U1.T1(DRAM_RESET_N) U2.T11(RESET_N)
DRAM_SDQS0_A_N: U1.D1(DRAM_DQS0_N) U2.V10(DQS1_c_B)
DRAM_SDQS0_A_P: U1.D2(DRAM_DQS0_P) U2.W10(DQS1_t_B)
DRAM_SDQS0_B_N: U1.AA1(DRAM_DQS2_N) U2.E3(DQS0_c_A)
DRAM_SDQS0_B_P: U1.AA2(DRAM_DQS2_P) U2.D3(DQS0_t_A)
DRAM_SDQS1_A_N: U1.J1(DRAM_DQS1_N) U2.V3(DQS0_c_B)
DRAM_SDQS1_A_P: U1.J2(DRAM_DQS1_P) U2.W3(DQS0_t_B)
DRAM_SDQS1_B_N: U1.AF1(DRAM_DQS3_N) U2.E10(DQS1_c_A)
DRAM_SDQS1_B_P: U1.AF2(DRAM_DQS3_P) U2.D10(DQS1_t_A)
DRAM_VREF: PTP7.1(TP) U1.R2(DRAM_VREF)
DRAM_ZQ0: PTP8.1(TP) R13.2 U2.A5(ZQ0)
DRAM_ZQ1: PTP11.1(TP) R15.2 U2.A8(ZQ1)
NetPTP9_1: PTP9.1(TP) R14.2 U1.R1(DRAM_ZN)
NetPTP10_1: PTP10.1(TP) U1.P2(DRAM_AC19/MTEST_/_MTEST)

Not connected (* = marked no-connect by the designer): U1 AC4(DRAM_AC37/--_/_ODT1)* AC5(DRAM_AC38/--_/_CS1_n)* G4(DRAM_AC06/--_/_ACT_n)* J5(DRAM_AC07/--_/_A9)* L5(DRAM_AC14/_--_/_A4)* N1(DRAM_AC16/--_/_CK_t_A)* N2(DRAM_AC17/--_/_CK_c_A)* P1(DRAM_AC26/--_/_BA1)* R4(DRAM_AC27/--_/_PARITY)* R5(DRAM_AC15/--_/_A3)* T2(DRAM_ALERT_N)* U1(DRAM_AC34/_--_/_WE_n(A14))* U2(DRAM_AC35/--_/_RAS_n(A16))* W6(DRAM_AC36/--_/_ODT0)*; U2 A1(DNU_A1)* A2(DNU_A2)* A11(DNU_A11)* A12(DNU_A12)* AA1(DNU_AA1)* AA12(DNU_AA12)* AB1(DNU_AB1)* AB2(DNU_AB2)* AB11(DNU_AB11)* AB12(DNU_AB12)* B1(DNU_B1)* B12(DNU_B12)* G11(NC_G11)* K5(NC_K5)* K8(NC_K8)* N5(NC_N5)* N8(NC_N8)*

### Layout directives
differential pair; differential pair class 85; net class DRAM: DRAM_CK_A_N, DRAM_CK_A_P, DRAM_CK_B_N, DRAM_CK_B_P, DRAM_SDQS0_A_N, DRAM_SDQS0_A_P, DRAM_SDQS0_B_N, DRAM_SDQS0_B_P, DRAM_SDQS1_A_N, DRAM_SDQS1_A_P, DRAM_SDQS1_B_N, DRAM_SDQS1_B_P
net class SINGLE; Single impedance: 50: DRAM_CA0_A, DRAM_CA0_B, DRAM_CA1_A, DRAM_CA1_B, DRAM_CA2_A, DRAM_CA2_B, DRAM_CA3_A, DRAM_CA3_B, DRAM_CA4_A, DRAM_CA4_B, DRAM_CA5_A, DRAM_CA5_B, DRAM_CKE0_A, DRAM_CKE0_B, DRAM_CKE1_A, DRAM_CKE1_B, DRAM_DATA0_A, DRAM_DATA0_B, DRAM_DATA1_A, DRAM_DATA1_B, DRAM_DATA2_A, DRAM_DATA2_B, DRAM_DATA3_A, DRAM_DATA3_B, DRAM_DATA4_A, DRAM_DATA4_B, DRAM_DATA5_A, DRAM_DATA5_B, DRAM_DATA6_A, DRAM_DATA6_B, DRAM_DATA7_A, DRAM_DATA7_B, DRAM_DATA8_A, DRAM_DATA8_B, DRAM_DATA9_A, DRAM_DATA9_B, DRAM_DATA10_A, DRAM_DATA10_B, DRAM_DATA11_A, DRAM_DATA11_B, DRAM_DATA12_A, DRAM_DATA12_B, DRAM_DATA13_A, DRAM_DATA13_B, DRAM_DATA14_A, DRAM_DATA14_B, DRAM_DATA15_A, DRAM_DATA15_B, DRAM_DMI0_A, DRAM_DMI0_B, DRAM_DMI1_A, DRAM_DMI1_B, DRAM_nCS0_A, DRAM_nCS0_B, DRAM_nCS1_A, DRAM_nCS1_B

### Notes on the sheet
- LPDDR4 4GB
- Power supply voltage sequence:
  RESET_n is held LOW.
  VDD1 >= VDD2
  VDD2 >= VDDQ
- 10k
- Data Bus
- Command/Address
- Pin Name
- LPDDR4
- DDR4
- Note:
- LPDDR4 ODT on i.MX 8M Plus is command-based, ODT_CA_A/B of LPDDR4 part should be connected directly to VDD2.
- (near R16) 150R
- (near R17) 150R
- DRAM_DQS0_P
  DRAM_DQS0_N
  DRAM_DM0
  DRAM_DQ00
  DRAM_DQ01
  DRAM_DQ02
  DRAM_DQ03
  DRAM_DQ04
  DRAM_DQ05
  DRAM_DQ06
  DRAM_DQ07
  DRAM_DQS1_P
  DRAM_DQS1_N
  DRAM_DM1
  DRAM_DQ08
  DRAM_DQ09
  DRAM_DQ10
  DRAM_DQ11
  DRAM_DQ12
  DRAM_DQ13
  DRAM_DQ14
  DRAM_DQ15
  DRAM_DQS2_P
  DRAM_DQS2_N
  DRAM_DM2
  DRAM_DQ16
  DRAM_DQ17
  DRAM_DQ18
  DRAM_DQ19
  DRAM_DQ20
  DRAM_DQ21
  DRAM_DQ22
  DRAM_DQ23
  DRAM_DQS3_P
  DRAM_DQS3_N
  DRAM_DM3
  DRAM_DQ24
  DRAM_DQ25
  DRAM_DQ26
  DRAM_DQ27
  DRAM_DQ28
  DRAM_DQ29
  DRAM_DQ30
  DRAM_DQ31
- DQS0_t_A
  DQS0_c_A
  DMI0_A
  DQ0_A
  DQ1_A
  DQ2_A
  DQ3_A
  DQ4_A
  DQ5_A
  DQ6_A
  DQ7_A
  DQS1_t_A
  DQS1_c_A
  DMI1_A
  DQ08_A
  DQ09_A
  DQ10_A
  DQ11_A
  DQ12_A
  DQ13_A
  DQ14_A
  DQ15_A
  DQS0_t_B
  DQS0_c_B
  DMI0_B
  DQ0_B
  DQ1_B
  DQ2_B
  DQ3_B
  DQ4_B
  DQ5_B
  DQ6_B
  DQ7_B
  DQS1_t_B
  DQS1_c_B
  DMI1_B
  DQ08_B
  DQ09_B
  DQ10_B
  DQ11_B
  DQ12_B
  DQ13_B
  DQ14_B
  DQ15_B
- DQSL_t_A
  DQSL_c_A
  DML_n_A / DBIL_n_A
  DQL0_A
  DQL1_A
  DQL2_A
  DQL3_A
  DQL4_A
  DQL5_A
  DQL6_A
  DQL7_A
  DQSU_t_A
  DQSU_c_A
  DMU_n_A / DBIU_n_A
  DQU0_A
  DQU1_A
  DQU2_A
  DQU3_A
  DQU4_A
  DQU5_A
  DQU6_A
  DQU7_A
  DQSL_t_B
  DQSL_c_B
  DML_n_B / DBIL_n_B
  DQL0_B
  DQL1_B
  DQL2_B
  DQL3_B
  DQL4_B
  DQL5_B
  DQL6_B
  DQL7_B
  DQSU_t_B
  DQSU_c_B
  DMU_n_B / DBIU_n_B
  DQU0_B
  DQU1_B
  DQU2_B
  DQU3_B
  DQU4_B
  DQU5_B
  DQU6_B
  DQU7_B
- DRAM_RESET_N
  DRAM_ALERT_N
  DRAM_AC00
  DRAM_AC01
  DRAM_AC02
  DRAM_AC03
  DRAM_AC04
  DRAM_AC05
  DRAM_AC06
  DRAM_AC07
  DRAM_AC08
  DRAM_AC09
  DRAM_AC10
  DRAM_AC11
  DRAM_AC12
  DRAM_AC13
  DRAM_AC14
  DRAM_AC15
  DRAM_AC16
  DRAM_AC17
  DRAM_AC19
  DRAM_AC20
  DRAM_AC21
  DRAM_AC22
  DRAM_AC23
  DRAM_AC24
  DRAM_AC25
  DRAM_AC26
  DRAM_AC27
  DRAM_AC28
  DRAM_AC29
  DRAM_AC30
  DRAM_AC31
  DRAM_AC32
  DRAM_AC33
  DRAM_AC34
  DRAM_AC35
  DRAM_AC36
  DRAM_AC37
  DRAM_AC38
  DRAM_ZN
  DRAM_VREF
- RESET_N
  MTEST1
  CKE0_A
  CKE1_A
  CS0_A
  CS1_A
  CK_t_A
  CK_c_A
  /
  /
  CA0_A
  CA1_A
  CA2_A
  CA3_A
  CA4_A
  CA5_A
  /
  /
  /
  /
  MTEST
  CKE0_B
  CKE1_B
  CS1_B
  CS0_B
  CK_t_B
  CK_c_B
  /
  /
  CA0_B
  CA1_B
  CA2_B
  CA3_B
  CA4_B
  CA5_B
  /
  /
  /
  /
  /
  ZQ
  VREF
- RESET_n
  ALERT_n / MTEST1
  CKE0
  CKE1
  CS0_n
  C0
  BG0
  BG1
  ACT_n
  A9
  A12
  A11
  A7
  A8
  A6
  A5
  A4
  A3
  CK_t_A
  CK_c_A
  MTEST
  CK_t_B
  CK_c_B
  /
  /
  A2
  A1
  BA1
  PARITY
  A13
  BA0
  A10 / AP
  A0
  C2
  CAS_n / A15
  WE_n / A14
  RAS_n / A16
  ODT0
  ODT1
  CS1_n
  ZQ
  VREF
- DWG NO:
- REV:
- THIS DOCUMENT AND THE DATA DISCLOSED HEREIN OR
- HEREWITH IS THE PROPERTY OF ALTIUM LIMITED AND MAY
- BE FREELY DISTRIBUTED IN WHOLE. NO RIGHTS ARE
- RESERVED OR EXPRESS OR IMPLIED WARANTEE GIVEN.
- REVISION
- DESCRIPTION
- DATE
- APPROVED
- ENG:
- APPROVALS
- PROJECT
- DSN:
- CHK:
- REFERENCE DOCUMENTS
- PROJECT REVISION:
- TITLE
- DOCUMENT REVISION:
- DESIGN ITEM:
- BOM:
- FAB DWG:
- PCB DWG:
- ASSY DWG:
- SCALE:
- A2
- SIZE
- CAGE CODE
- FILE NAME
- DWG NO.
- SHEET
- OF
- REV
- (in symbol CMP-001-000983-8, part A) i.MX8MP - DDR; (LPDDR4/DDR4)

### Library data of the parts
C61 C62 C67 C68 C75 = CMP-001-000883-14: CAP; Part Number: GMC04X6S106M6R3NT; Manufacturer: Cal-Chip Electronics; Voltage: 6.3V; Tolerance: +/-20%; Temperature characteristics: X6S; Sort order: 304; HasBeenBuilt: TBD; Alternative component: Allowed; System: RLC; Package: 0402; ComponentLink1Description: 1_Datasheet; ComponentLink2Description: 2_Product page; ComponentLink3Description: 3_X-information; ComponentLink4Description: 4_X-information; Creation date: 26042024; Manufacturer Part Number: GMC04X6S106M6R3NT; Component Type: Capacitor
C63-C66 C69-C74 C76-C82 = CMP-001-000336-15: CAP; Part Number: KGM03CS61A105MH; Manufacturer: KYOCERA AVX; Temperature characteristics: X6S; Voltage: 10V; Tolerance: +/-20%; Sort order: 302; HasBeenBuilt: False; Alternative component: Allowed; System: RLC; Package: 0201; Operating temperature range: -55C to +105C; ClassName: SMALL; ComponentLink1Description: 1_Datasheet; ComponentLink2Description: 2_Product page; ComponentLink3Description: 3_X-information; ComponentLink4Description: 4_X-information; Creation date: 20190101; Source: RLC_UN1Q.SchLib; Manufacturer Part Number: KGM03CS61A105MH; Component Type: Capacitor
PTP6-PTP11 = CMP-001-001296-3: Production Testpoint 0.4mm. Flying probe. Use 1mm pitch.; Part Number: PTP 0.4mm; ComponentLink4Description: 4_X-information; ComponentLink1Description: 1_Datasheet; Sort order: -; ClassName: SMALL; System: Test Point; HasBeenBuilt: -; Design Item ID: PTP_0.4mm; ComponentLink3Description: 3_X-information; Creation date: 20240909; ComponentLink2Description: 2_Product page; Component Type: Test Point
R8-R11 R16 R17 = CMP-001-000434-10: Not Assembled - RES; Sort order: 999; HasBeenBuilt: TBD; System: RLC; Package: 0201; ClassName: SMALL; ComponentLink1Description: 1_Datasheet; ComponentLink2Description: 2_Product page; ComponentLink3Description: 3_X-information; ComponentLink4Description: 4_X-information; Creation date: 20190101; Source: RLC_UN1Q.SchLib; Component Type: Resistor
R12 = CMP-001-000446-13: RES; Part Number: RC0201FR-0710KL; Manufacturer: YAGEO; Power Rating: 1/20W; Sort order: 322; HasBeenBuilt: TBD; Tolerance: 1%; Alternative component: Allowed; System: RLC; Package: 0201; ClassName: SMALL; ComponentLink1Description: 1_Datasheet; ComponentLink2Description: 2_Product page; ComponentLink3Description: 3_X-information; ComponentLink4Description: 4_X-information; Creation date: 20190101; Source: RLC_UN1Q.SchLib; Component Type: Resistor
R13-R15 = CMP-001-000554-13: RES; Part Number: ERJ-1GEJ241C; Manufacturer: Panasonic Electronic Components; Tolerance: 1%; Power Rating: 1/20W; Sort order: 322; HasBeenBuilt: TBD; Alternative component: Allowed; System: RLC; Package: 0201; ClassName: SMALL; ComponentLink1Description: 1_Datasheet; ComponentLink2Description: 2_Product page; ComponentLink3Description: 3_X-information; ComponentLink4Description: 4_X-information; Creation date: 20190101; Source: RLC_UN1Q.SchLib; Component Type: Resistor
U1 = CMP-001-000983-8: CPU QUAD CORTEX A53+M4 1.6GHZ BGA548 Industrial; Manufacturer: NXP Semiconductors; Sort order: 501; System: IC; ComponentLink1Description: 1_Datasheet; ComponentLink1URL: https://www.nxp.com/part/MIMX8ML8CVNKZAB#/; ComponentLink2Description: 2_Product page; ComponentLink3Description: 3_X-information; ComponentLink4Description: 4_X-information; Creation date: 20240524; Dimensions WxLxH: 15 x 15 x 1.33mm; Operating temperature range: -40... +105 °C; Package: FCBGA548; Part Number: MIMX8ML8CVNKZAB; ClassName: BIG; Source: UUDET_KOMPONENTIT.SchLib; Design Item ID: MIMX8ML8CVNKZAB; Manufacturer Part Number: MIMX8ML8CVNKZAB; Component Type: Processor
U2 = CMP-001-001446-1: MEM LPDDR4 SDRAM 2133MHz 2Gx32Gb 1.1V; Manufacturer: Micron; Sort order: 511; System: IC; ComponentLink1Description: 1_Datasheet; ComponentLink1URL: https://www.micron.com/products/memory/dram-components/lpddr4/part-catalog/part-detail/mt53e2g32d4de-046-aat-c#login-modal; ComponentLink2Description: 2_Product page; ComponentLink2URL: https://www.micron.com/products/memory/dram-components/lpddr4/part-catalog/part-detail/mt53e2g32d4de-046-aat-c; ComponentLink3Description: 3_X-information; ComponentLink4Description: 4_X-information; Creation Date: 20250619; Dimensions WxLxH: 10x14.5x1.2mm; Operating temperature range: -40 .... +105 °C; Package: TFBGA-200; ECCN: EAR99; ClassName: BIG; Design Item ID: MT53E2G32D4DE-046 AAT:C; Manufacturer Part Number: MT53E2G32D4DE-046 AAT:C; Component Type: Memory; Part Number: MT53E2G32D4DE-046 AAT:C

## Sheet IMX8_PHY.SchDoc
size 594 x 420 mm; SheetNumber: 7; SheetTotal: 12
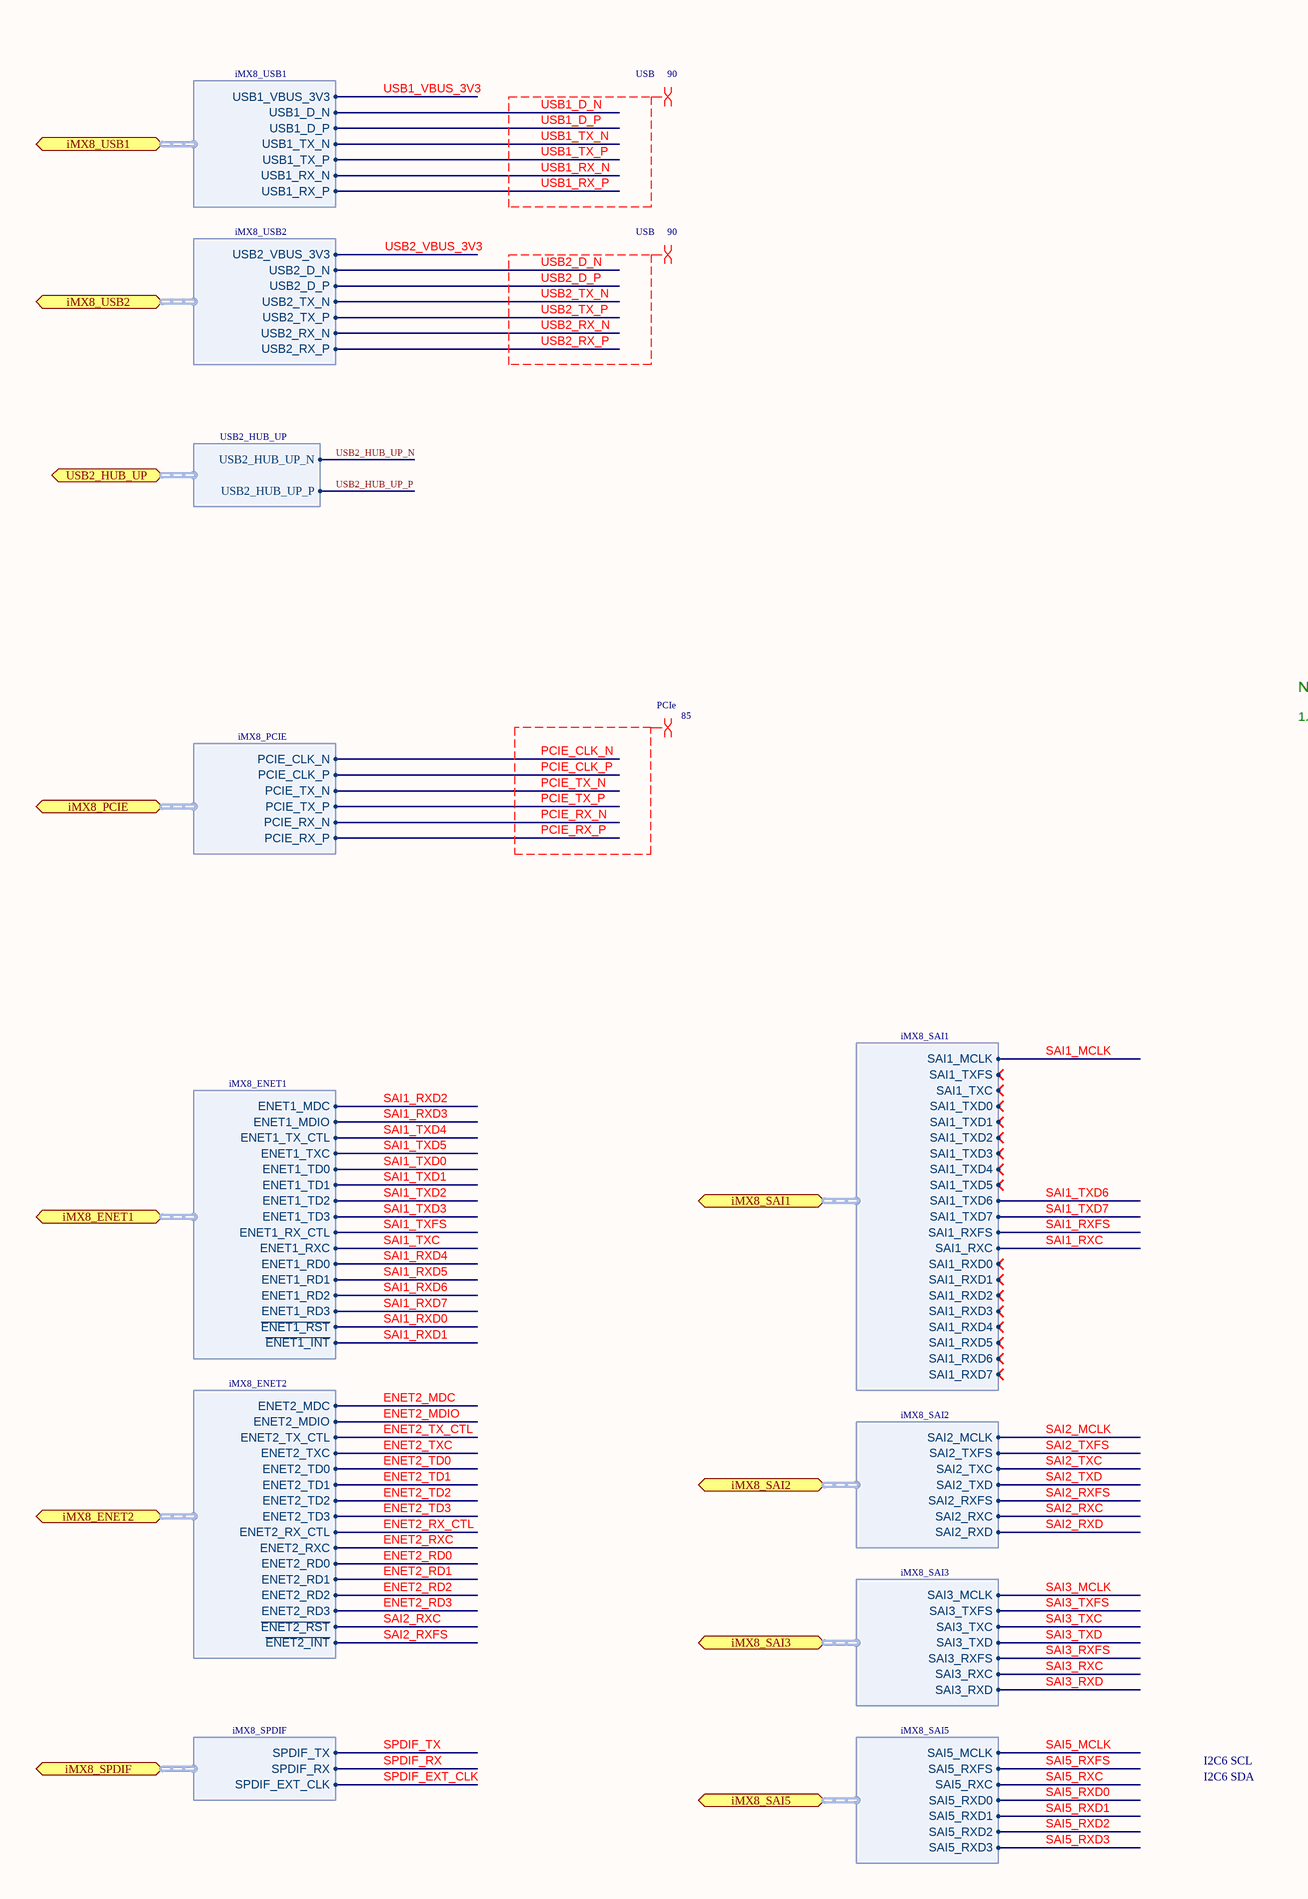
[diagram p14: IMX8_PHY.SchDoc, left]
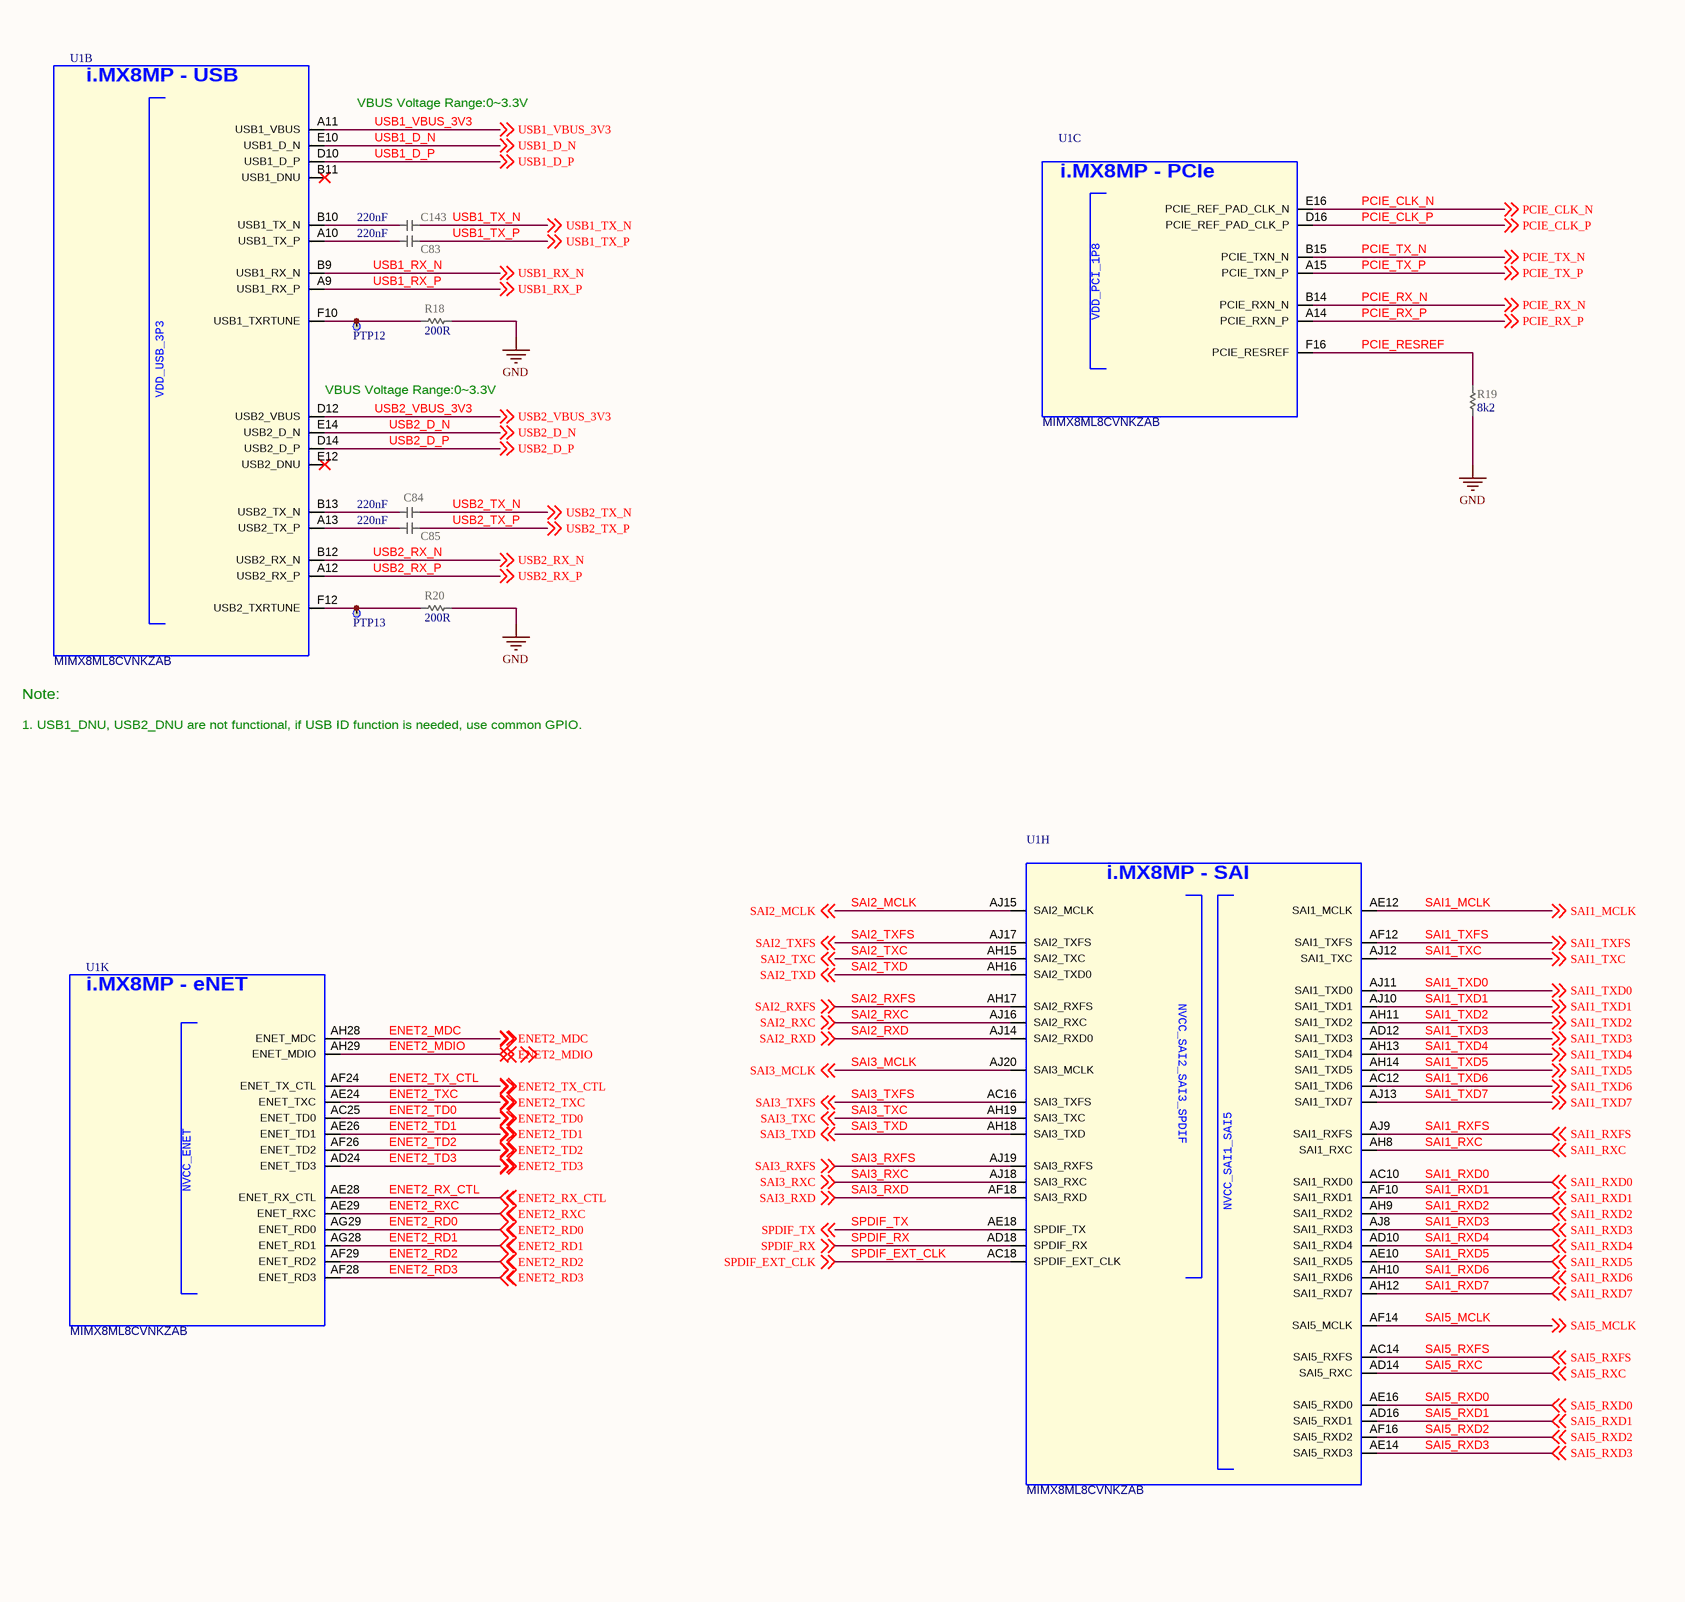
[diagram p15: IMX8_PHY.SchDoc, right]

### Parts
C83  value 220nF  [CAP_0201_UN1Q]  (hidden comment: CAP_0201_220n_10V_X6S)
C84  value 220nF  [CAP_0201_UN1Q]  (hidden comment: CAP_0201_220n_10V_X6S)
C85  value 220nF  [CAP_0201_UN1Q]  (hidden comment: CAP_0201_220n_10V_X6S)
C143  value 220nF  [CAP_0201_UN1Q]  (hidden comment: CAP_0201_220n_10V_X6S)
PTP12  PTP_0.4mm  [PTP_0.4mm]  (value not drawn)  (no BOM)
PTP13  PTP_0.4mm  [PTP_0.4mm]  (value not drawn)  (no BOM)
R18  value 200R  [RES_0201_UN1Q]  (hidden comment: RES_0201_200R)
R19  value 8k2  [RES_0201_UN1Q]  (hidden comment: RES_0201_8k2)
R20  value 200R  [RES_0201_UN1Q]  (hidden comment: RES_0201_200R)
U1  MIMX8ML8CVNKZAB  [BGA548C50P29X29_1500X1500X148]  (parts B,C,H,K of 15)

### Ports
iMX8_ENET1 (bidir, harness iMX8_ENET1), iMX8_ENET2 (bidir, harness iMX8_ENET2), iMX8_PCIE (bidir, harness iMX8_PCIE), iMX8_SAI1 (bidir, harness iMX8_SAI1), iMX8_SAI2 (bidir, harness iMX8_SAI2), iMX8_SAI3 (bidir, harness iMX8_SAI3), iMX8_SAI5 (bidir, harness iMX8_SAI5), iMX8_SPDIF (bidir, harness iMX8_SPDIF), iMX8_USB1 (bidir, harness iMX8_USB1), iMX8_USB2 (bidir, harness iMX8_USB2), USB2_HUB_UP (bidir, harness USB2_HUB_UP)

### Harnesses
iMX8_USB1: USB1_VBUS_3V3, USB1_D_N, USB1_D_P, USB1_TX_N, USB1_TX_P, USB1_RX_N, USB1_RX_P
iMX8_USB2: USB2_VBUS_3V3, USB2_D_N, USB2_D_P, USB2_TX_N, USB2_TX_P, USB2_RX_N, USB2_RX_P
USB2_HUB_UP: USB2_HUB_UP_P, USB2_HUB_UP_N
iMX8_ENET1: ENET1_MDC, ENET1_MDIO, ENET1_TX_CTL, ENET1_TXC, ENET1_TD0, ENET1_TD1, ENET1_TD2, ENET1_TD3, ENET1_RX_CTL, ENET1_RXC, ENET1_RD0, ENET1_RD1, ENET1_RD2, ENET1_RD3, ~{ENET1_RST}, ~{ENET1_INT}
iMX8_ENET2: ENET2_MDC, ENET2_MDIO, ENET2_TX_CTL, ENET2_TXC, ENET2_TD0, ENET2_TD1, ENET2_TD2, ENET2_TD3, ENET2_RX_CTL, ENET2_RXC, ENET2_RD0, ENET2_RD1, ENET2_RD2, ENET2_RD3, ~{ENET2_RST}, ~{ENET2_INT}
iMX8_PCIE: PCIE_CLK_N, PCIE_CLK_P, PCIE_TX_N, PCIE_TX_P, PCIE_RX_N, PCIE_RX_P
iMX8_SPDIF: SPDIF_TX, SPDIF_RX, SPDIF_EXT_CLK
iMX8_SAI2: SAI2_MCLK, SAI2_TXFS, SAI2_TXC, SAI2_TXD, SAI2_RXFS, SAI2_RXC, SAI2_RXD
iMX8_SAI3: SAI3_MCLK, SAI3_TXFS, SAI3_TXC, SAI3_TXD, SAI3_RXFS, SAI3_RXC, SAI3_RXD
iMX8_SAI5: SAI5_MCLK, SAI5_RXFS, SAI5_RXC, SAI5_RXD0, SAI5_RXD1, SAI5_RXD2, SAI5_RXD3
iMX8_SAI1: SAI1_MCLK, SAI1_TXFS, SAI1_TXC, SAI1_TXD0, SAI1_TXD1, SAI1_TXD2, SAI1_TXD3, SAI1_TXD4, SAI1_TXD5, SAI1_TXD6, SAI1_TXD7, SAI1_RXFS, SAI1_RXC, SAI1_RXD0, SAI1_RXD1, SAI1_RXD2, SAI1_RXD3, SAI1_RXD4, SAI1_RXD5, SAI1_RXD6, SAI1_RXD7

### Nets
GND: R18.1 R19.1 R20.1
ENET2_MDC: U1.AH28(ENET_MDC) ; off-sheet ENET2_MDC, port iMX8_ENET2.ENET2_MDC
ENET2_MDIO: U1.AH29(ENET_MDIO) ; off-sheet ENET2_MDIO, port iMX8_ENET2.ENET2_MDIO
ENET2_RD0: U1.AG29(ENET_RD0) ; off-sheet ENET2_RD0, port iMX8_ENET2.ENET2_RD0
ENET2_RD1: U1.AG28(ENET_RD1) ; off-sheet ENET2_RD1, port iMX8_ENET2.ENET2_RD1
ENET2_RD2: U1.AF29(ENET_RD2) ; off-sheet ENET2_RD2, port iMX8_ENET2.ENET2_RD2
ENET2_RD3: U1.AF28(ENET_RD3) ; off-sheet ENET2_RD3, port iMX8_ENET2.ENET2_RD3
ENET2_RX_CTL: U1.AE28(ENET_RX_CTL) ; off-sheet ENET2_RX_CTL, port iMX8_ENET2.ENET2_RX_CTL
ENET2_RXC: U1.AE29(ENET_RXC) ; off-sheet ENET2_RXC, port iMX8_ENET2.ENET2_RXC
ENET2_TD0: U1.AC25(ENET_TD0) ; off-sheet ENET2_TD0, port iMX8_ENET2.ENET2_TD0
ENET2_TD1: U1.AE26(ENET_TD1) ; off-sheet ENET2_TD1, port iMX8_ENET2.ENET2_TD1
ENET2_TD2: U1.AF26(ENET_TD2) ; off-sheet ENET2_TD2, port iMX8_ENET2.ENET2_TD2
ENET2_TD3: U1.AD24(ENET_TD3) ; off-sheet ENET2_TD3, port iMX8_ENET2.ENET2_TD3
ENET2_TX_CTL: U1.AF24(ENET_TX_CTL) ; off-sheet ENET2_TX_CTL, port iMX8_ENET2.ENET2_TX_CTL
ENET2_TXC: U1.AE24(ENET_TXC) ; off-sheet ENET2_TXC, port iMX8_ENET2.ENET2_TXC
PCIE_CLK_N: U1.E16(PCIE_REF_PAD_CLK_N) ; off-sheet PCIE_CLK_N, port iMX8_PCIE.PCIE_CLK_N
PCIE_CLK_P: U1.D16(PCIE_REF_PAD_CLK_P) ; off-sheet PCIE_CLK_P, port iMX8_PCIE.PCIE_CLK_P
PCIE_RESREF: R19.2 U1.F16(PCIE_RESREF)
PCIE_RX_N: U1.B14(PCIE_RXN_N) ; off-sheet PCIE_RX_N, port iMX8_PCIE.PCIE_RX_N
PCIE_RX_P: U1.A14(PCIE_RXN_P) ; off-sheet PCIE_RX_P, port iMX8_PCIE.PCIE_RX_P
PCIE_TX_N: U1.B15(PCIE_TXN_N) ; off-sheet PCIE_TX_N, port iMX8_PCIE.PCIE_TX_N
PCIE_TX_P: U1.A15(PCIE_TXN_P) ; off-sheet PCIE_TX_P, port iMX8_PCIE.PCIE_TX_P
SAI1_MCLK: U1.AE12(SAI1_MCLK) ; off-sheet SAI1_MCLK, port iMX8_SAI1.SAI1_MCLK
SAI1_RXC: U1.AH8(SAI1_RXC) ; off-sheet SAI1_RXC, port iMX8_SAI1.SAI1_RXC
SAI1_RXD0: U1.AC10(SAI1_RXD0) ; off-sheet SAI1_RXD0, port iMX8_ENET1.~{ENET1_RST}
SAI1_RXD1: U1.AF10(SAI1_RXD1) ; off-sheet SAI1_RXD1, port iMX8_ENET1.~{ENET1_INT}
SAI1_RXD2: U1.AH9(SAI1_RXD2) ; off-sheet SAI1_RXD2, port iMX8_ENET1.ENET1_MDC
SAI1_RXD3: U1.AJ8(SAI1_RXD3) ; off-sheet SAI1_RXD3, port iMX8_ENET1.ENET1_MDIO
SAI1_RXD4: U1.AD10(SAI1_RXD4) ; off-sheet SAI1_RXD4, port iMX8_ENET1.ENET1_RD0
SAI1_RXD5: U1.AE10(SAI1_RXD5) ; off-sheet SAI1_RXD5, port iMX8_ENET1.ENET1_RD1
SAI1_RXD6: U1.AH10(SAI1_RXD6) ; off-sheet SAI1_RXD6, port iMX8_ENET1.ENET1_RD2
SAI1_RXD7: U1.AH12(SAI1_RXD7) ; off-sheet SAI1_RXD7, port iMX8_ENET1.ENET1_RD3
SAI1_RXFS: U1.AJ9(SAI1_RXFS) ; off-sheet SAI1_RXFS, port iMX8_SAI1.SAI1_RXFS
SAI1_TXC: U1.AJ12(SAI1_TXC) ; off-sheet SAI1_TXC, port iMX8_ENET1.ENET1_RXC
SAI1_TXD0: U1.AJ11(SAI1_TXD0) ; off-sheet SAI1_TXD0, port iMX8_ENET1.ENET1_TD0
SAI1_TXD1: U1.AJ10(SAI1_TXD1) ; off-sheet SAI1_TXD1, port iMX8_ENET1.ENET1_TD1
SAI1_TXD2: U1.AH11(SAI1_TXD2) ; off-sheet SAI1_TXD2, port iMX8_ENET1.ENET1_TD2
SAI1_TXD3: U1.AD12(SAI1_TXD3) ; off-sheet SAI1_TXD3, port iMX8_ENET1.ENET1_TD3
SAI1_TXD4: U1.AH13(SAI1_TXD4) ; off-sheet SAI1_TXD4, port iMX8_ENET1.ENET1_TX_CTL
SAI1_TXD5: U1.AH14(SAI1_TXD5) ; off-sheet SAI1_TXD5, port iMX8_ENET1.ENET1_TXC
SAI1_TXD6: U1.AC12(SAI1_TXD6) ; off-sheet SAI1_TXD6, port iMX8_SAI1.SAI1_TXD6
SAI1_TXD7: U1.AJ13(SAI1_TXD7) ; off-sheet SAI1_TXD7, port iMX8_SAI1.SAI1_TXD7
SAI1_TXFS: U1.AF12(SAI1_TXFS) ; off-sheet SAI1_TXFS, port iMX8_ENET1.ENET1_RX_CTL
SAI2_MCLK: U1.AJ15(SAI2_MCLK) ; off-sheet SAI2_MCLK, port iMX8_SAI2.SAI2_MCLK
SAI2_RXC: U1.AJ16(SAI2_RXC) ; off-sheet SAI2_RXC, port iMX8_ENET2.~{ENET2_RST}, port iMX8_SAI2.SAI2_RXC
SAI2_RXD: U1.AJ14(SAI2_RXD0) ; off-sheet SAI2_RXD, port iMX8_SAI2.SAI2_RXD
SAI2_RXFS: U1.AH17(SAI2_RXFS) ; off-sheet SAI2_RXFS, port iMX8_ENET2.~{ENET2_INT}, port iMX8_SAI2.SAI2_RXFS
SAI2_TXC: U1.AH15(SAI2_TXC) ; off-sheet SAI2_TXC, port iMX8_SAI2.SAI2_TXC
SAI2_TXD: U1.AH16(SAI2_TXD0) ; off-sheet SAI2_TXD, port iMX8_SAI2.SAI2_TXD
SAI2_TXFS: U1.AJ17(SAI2_TXFS) ; off-sheet SAI2_TXFS, port iMX8_SAI2.SAI2_TXFS
SAI3_MCLK: U1.AJ20(SAI3_MCLK) ; off-sheet SAI3_MCLK, port iMX8_SAI3.SAI3_MCLK
SAI3_RXC: U1.AJ18(SAI3_RXC) ; off-sheet SAI3_RXC, port iMX8_SAI3.SAI3_RXC
SAI3_RXD: U1.AF18(SAI3_RXD) ; off-sheet SAI3_RXD, port iMX8_SAI3.SAI3_RXD
SAI3_RXFS: U1.AJ19(SAI3_RXFS) ; off-sheet SAI3_RXFS, port iMX8_SAI3.SAI3_RXFS
SAI3_TXC: U1.AH19(SAI3_TXC) ; off-sheet SAI3_TXC, port iMX8_SAI3.SAI3_TXC
SAI3_TXD: U1.AH18(SAI3_TXD) ; off-sheet SAI3_TXD, port iMX8_SAI3.SAI3_TXD
SAI3_TXFS: U1.AC16(SAI3_TXFS) ; off-sheet SAI3_TXFS, port iMX8_SAI3.SAI3_TXFS
SAI5_MCLK: U1.AF14(SAI5_MCLK) ; off-sheet SAI5_MCLK, port iMX8_SAI5.SAI5_MCLK
SAI5_RXC: U1.AD14(SAI5_RXC) ; off-sheet SAI5_RXC, port iMX8_SAI5.SAI5_RXC  [project net I2C6_SDA]
SAI5_RXD0: U1.AE16(SAI5_RXD0) ; off-sheet SAI5_RXD0, port iMX8_SAI5.SAI5_RXD0
SAI5_RXD1: U1.AD16(SAI5_RXD1) ; off-sheet SAI5_RXD1, port iMX8_SAI5.SAI5_RXD1
SAI5_RXD2: U1.AF16(SAI5_RXD2) ; off-sheet SAI5_RXD2, port iMX8_SAI5.SAI5_RXD2
SAI5_RXD3: U1.AE14(SAI5_RXD3) ; off-sheet SAI5_RXD3, port iMX8_SAI5.SAI5_RXD3
SAI5_RXFS: U1.AC14(SAI5_RXFS) ; off-sheet SAI5_RXFS, port iMX8_SAI5.SAI5_RXFS  [project net I2C6_SCL]
SPDIF_EXT_CLK: U1.AC18(SPDIF_EXT_CLK) ; off-sheet SPDIF_EXT_CLK, port iMX8_SPDIF.SPDIF_EXT_CLK  [project net I2C5_SDA]
SPDIF_RX: U1.AD18(SPDIF_RX) ; off-sheet SPDIF_RX, port iMX8_SPDIF.SPDIF_RX
SPDIF_TX: U1.AE18(SPDIF_TX) ; off-sheet SPDIF_TX, port iMX8_SPDIF.SPDIF_TX  [project net I2C5_SCL]
USB1_D_N: U1.E10(USB1_D_N) ; off-sheet USB1_D_N, port iMX8_USB1.USB1_D_N
USB1_D_P: U1.D10(USB1_D_P) ; off-sheet USB1_D_P, port iMX8_USB1.USB1_D_P
USB1_RX_N: U1.B9(USB1_RX_N) ; off-sheet USB1_RX_N, port iMX8_USB1.USB1_RX_N
USB1_RX_P: U1.A9(USB1_RX_P) ; off-sheet USB1_RX_P, port iMX8_USB1.USB1_RX_P
USB1_TX_N: C143.2 ; off-sheet USB1_TX_N, port iMX8_USB1.USB1_TX_N
USB1_TX_P: C83.1 ; off-sheet USB1_TX_P, port iMX8_USB1.USB1_TX_P
USB1_VBUS_3V3: U1.A11(USB1_VBUS) ; off-sheet USB1_VBUS_3V3, port iMX8_USB1.USB1_VBUS_3V3
USB2_D_N: U1.E14(USB2_D_N) ; off-sheet USB2_D_N, port iMX8_USB2.USB2_D_N
USB2_D_P: U1.D14(USB2_D_P) ; off-sheet USB2_D_P, port iMX8_USB2.USB2_D_P
USB2_HUB_UP_N: port USB2_HUB_UP.USB2_HUB_UP_N
USB2_HUB_UP_P: port USB2_HUB_UP.USB2_HUB_UP_P
USB2_RX_N: U1.B12(USB2_RX_N) ; off-sheet USB2_RX_N, port iMX8_USB2.USB2_RX_N
USB2_RX_P: U1.A12(USB2_RX_P) ; off-sheet USB2_RX_P, port iMX8_USB2.USB2_RX_P
USB2_TX_N: C84.2 ; off-sheet USB2_TX_N, port iMX8_USB2.USB2_TX_N
USB2_TX_P: C85.2 ; off-sheet USB2_TX_P, port iMX8_USB2.USB2_TX_P
USB2_VBUS_3V3: U1.D12(USB2_VBUS) ; off-sheet USB2_VBUS_3V3, port iMX8_USB2.USB2_VBUS_3V3
NetC83_2: C83.2 U1.A10(USB1_TX_P)
NetC84_1: C84.1 U1.B13(USB2_TX_N)
NetC85_1: C85.1 U1.A13(USB2_TX_P)
NetC143_1: C143.1 U1.B10(USB1_TX_N)
NetPTP12_1: PTP12.1(TP) R18.2 U1.F10(USB1_TXRTUNE)
NetPTP13_1: PTP13.1(TP) R20.2 U1.F12(USB2_TXRTUNE)

Not connected (* = marked no-connect by the designer): U1 B11(USB1_DNU)* E12(USB2_DNU)*

### Layout directives
differential pair; differential pair class 90; net class USB; rule Matched Net Lengths [Tolerance = 0.3mm]: USB1_D_N, USB1_D_P, USB1_RX_N, USB1_RX_P, USB1_TX_N, USB1_TX_P, USB2_D_N, USB2_D_P, USB2_RX_N, USB2_RX_P, USB2_TX_N, USB2_TX_P
differential pair; net class PCIe; rule Matched Net Lengths [Tolerance = 0.1mm]; differential pair class 85: PCIE_CLK_N, PCIE_CLK_P, PCIE_RX_N, PCIE_RX_P, PCIE_TX_N, PCIE_TX_P

### Notes on the sheet
- (near U1) VBUS Voltage Range:0~3.3V
- 1. USB1_DNU, USB2_DNU are not functional, if USB ID function is needed, use common GPIO.
- Note:
- I2C6 SDA
- I2C6 SCL
- DWG NO:
- REV:
- THIS DOCUMENT AND THE DATA DISCLOSED HEREIN OR
- HEREWITH IS THE PROPERTY OF ALTIUM LIMITED AND MAY
- BE FREELY DISTRIBUTED IN WHOLE. NO RIGHTS ARE
- RESERVED OR EXPRESS OR IMPLIED WARANTEE GIVEN.
- REVISION
- DESCRIPTION
- DATE
- APPROVED
- ENG:
- APPROVALS
- PROJECT
- DSN:
- CHK:
- REFERENCE DOCUMENTS
- PROJECT REVISION:
- TITLE
- DOCUMENT REVISION:
- DESIGN ITEM:
- BOM:
- FAB DWG:
- PCB DWG:
- ASSY DWG:
- SCALE:
- A2
- SIZE
- CAGE CODE
- FILE NAME
- DWG NO.
- SHEET
- OF
- REV
- (in symbol CMP-001-000983-8, part B) i.MX8MP - USB
- (in symbol CMP-001-000983-8, part C) i.MX8MP - PCIe
- (in symbol CMP-001-000983-8, part H) i.MX8MP - SAI
- (in symbol CMP-001-000983-8, part K) i.MX8MP - eNET

### Library data of the parts
C83-C85 C143 = CMP-001-000889-11: CAP; Part Number: GRM033C81A224KE01D; Manufacturer: Murata; Temperature characteristics: X6S; Voltage: 10V; Tolerance: +/-20%; Sort order: 302; HasBeenBuilt: TBD; Alternative component: Allowed; System: RLC; Package: 0201; Dimensions WxLxH: 0.35; ComponentLink1Description: 1_Datasheet; ComponentLink2Description: 2_Product page; ComponentLink3Description: 3_X-information; ComponentLink4Description: 4_X-information; Creation date: 26042024; ClassName: SMALL; Manufacturer Part Number: GRM033C81A224KE01D; Component Type: Capacitor
PTP12 PTP13 = CMP-001-001296-3: Production Testpoint 0.4mm. Flying probe. Use 1mm pitch.; ComponentLink4Description: 4_X-information; ComponentLink1Description: 1_Datasheet; Part Number: PTP 0.4mm; Sort order: -; ClassName: SMALL; System: Test Point; HasBeenBuilt: -; Design Item ID: PTP_0.4mm; ComponentLink3Description: 3_X-information; Creation date: 20240909; ComponentLink2Description: 2_Product page
R18 R20 = CMP-001-000549-13: RES; Part Number: CRCW0201200RFNED; Manufacturer: Vishay Dale; Tolerance: 1%; Power Rating: 1/20W; Sort order: 322; HasBeenBuilt: TBD; Alternative component: Allowed; System: RLC; Package: 0201; ClassName: SMALL; ComponentLink1Description: 1_Datasheet; ComponentLink2Description: 2_Product page; ComponentLink3Description: 3_X-information; ComponentLink4Description: 4_X-information; Creation date: 20190101; Source: RLC_UN1Q.SchLib
R19 = CMP-001-001255-9: RES; Part Number: ERJ1GNF8201C; Manufacturer: Panasonic; Tolerance: 1%; Power Rating: 1/20W; Sort order: 322; Alternative component: Allowed; System: RLC; Package: 0201; ClassName: SMALL; ComponentLink1Description: 1_Datasheet; ComponentLink2Description: 2_Product page; ComponentLink3Description: 3_X-information; ComponentLink4Description: 4_X-information; Creation date: 20240404; Manufacturer Part Number: ERJ1GNF8201C; Component Type: Resistor
U1 = CMP-001-000983-8: as U1 on sheet IMX8_LPDDR4; ComponentLink1Description: 1_Datasheet; ComponentLink1URL: https://www.nxp.com/part/MIMX8ML8CVNKZAB#/; ComponentLink2Description: 2_Product page; ComponentLink3Description: 3_X-information; ComponentLink4Description: 4_X-information; Creation date: 20240524; Dimensions WxLxH: 15 x 15 x 1.33mm; Operating temperature range: -40... +105 °C; Package: FCBGA548; Part Number: MIMX8ML8CVNKZAB; ClassName: BIG; Source: UUDET_KOMPONENTIT.SchLib; Design Item ID: MIMX8ML8CVNKZAB; Manufacturer Part Number: MIMX8ML8CVNKZAB; Component Type: Processor